# EAGLE design Proiect (EAGLE 9.7.0)

## Sheet 1 of 2
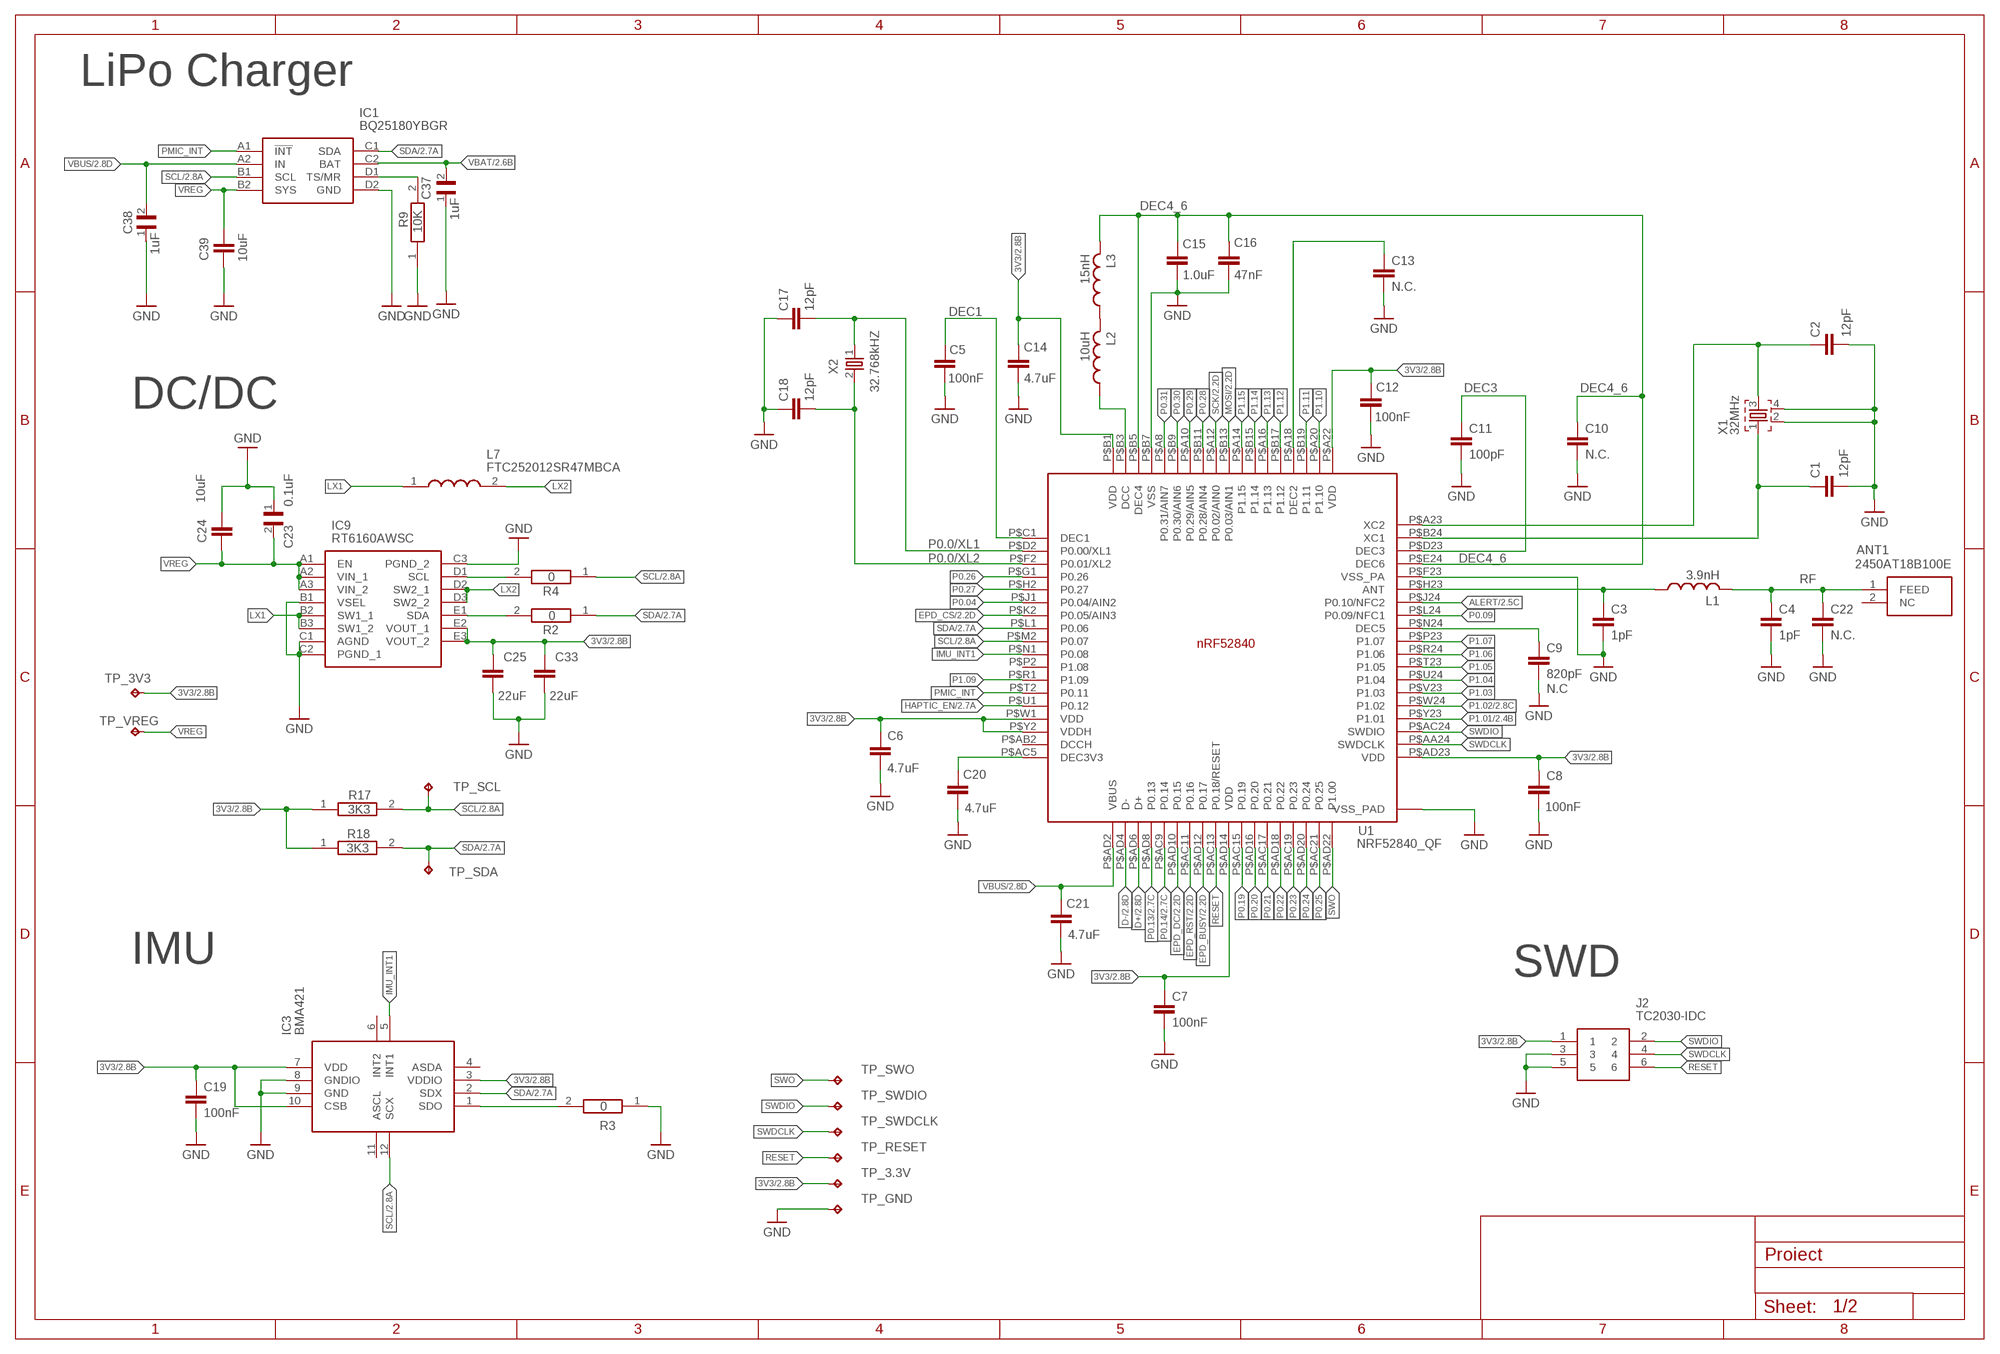
[diagram p0: schematic, sheet 1]

### Parts
ANT1  2450AT18B100E  2450AT18B100E_2450AT18B100E  [2450AT18B100E_ANTC3216X140N]
C1  12pF  NORDIC_NRF_3_CAPACITOR_0201_L  [NORDIC_NRF_3_RESC0201_L]
C2  12pF  NORDIC_NRF_3_CAPACITOR_0201_L  [NORDIC_NRF_3_RESC0201_L]
C3  1pF  NORDIC_NRF_3_CAPACITOR_0201_L  [NORDIC_NRF_3_RESC0201_L]
C4  1pF  NORDIC_NRF_3_CAPACITOR_0201_L  [NORDIC_NRF_3_RESC0201_L]
C5  100nF  PERFECT_0402_CAP_0402  [PERFECT_0402_0402]
C6  4.7uF  PERFECT_0402_CAP_0402  [PERFECT_0402_0402]
C7  100nF  NORDIC_NRF_3_CAPACITOR_0201_L  [NORDIC_NRF_3_RESC0201_L]
C8  100nF  NORDIC_NRF_3_CAPACITOR_0201_L  [NORDIC_NRF_3_RESC0201_L]
C9  820pF  NORDIC_NRF_3_CAPACITOR_0201_L  [NORDIC_NRF_3_RESC0201_L]
C10  N.C.  NORDIC_NRF_3_CAPACITOR_0201_L  [NORDIC_NRF_3_RESC0201_L]
C11  100pF  NORDIC_NRF_3_CAPACITOR_0201_L  [NORDIC_NRF_3_RESC0201_L]
C12  100nF  NORDIC_NRF_3_CAPACITOR_0201_L  [NORDIC_NRF_3_RESC0201_L]
C13  N.C.  NORDIC_NRF_3_CAPACITOR_0201_L  [NORDIC_NRF_3_RESC0201_L]
C14  4.7uF  PERFECT_0402_CAP_0402  [PERFECT_0402_0402]
C15  1.0uF  PERFECT_0402_CAP_0402  [PERFECT_0402_0402]
C16  47nF  NORDIC_NRF_3_CAPACITOR_0201_L  [NORDIC_NRF_3_RESC0201_L]
C17  12pF  NORDIC_NRF_3_CAPACITOR_0201_L  [NORDIC_NRF_3_RESC0201_L]
C18  12pF  NORDIC_NRF_3_CAPACITOR_0201_L  [NORDIC_NRF_3_RESC0201_L]
C19  100nF  NORDIC_NRF_3_CAPACITOR_0201_L  [NORDIC_NRF_3_RESC0201_L]
C20  4.7uF  PERFECT_0402_CAP_0402  [PERFECT_0402_0402]
C21  4.7uF  PERFECT_0402_CAP_0402  [PERFECT_0402_0402]
C22  N.C.  NORDIC_NRF_3_CAPACITOR_0201_L  [NORDIC_NRF_3_RESC0201_L]
C23  0.1uF  GRM011R60J152KE01L_1_GRM011R60J152KE01L  [GRM011R60J152KE01L_1_0201]
C24  10uF  PERFECT_0402_CAP_0402  [PERFECT_0402_0402]
C25  22uF  PERFECT_0402_CAP_0402  [PERFECT_0402_0402]
C33  22uF  PERFECT_0402_CAP_0402  [PERFECT_0402_0402]
C37  1uF  GRM011R60J152KE01L_1_GRM011R60J152KE01L  [GRM011R60J152KE01L_1_0201]
C38  1uF  GRM011R60J152KE01L_1_GRM011R60J152KE01L  [GRM011R60J152KE01L_1_0201]
C39  10uF  PERFECT_0402_CAP_0402  [PERFECT_0402_0402]
IC1  BQ25180YBGR  BQ25180YBGR_BQ25180YBGR  [BQ25180YBGR_BGA8C40P2X4_100X155X50]
IC3  BMA421  BMA423_BMA423  [BMA423_BMA423]
IC9  RT6160AWSC  RT6160AWSC_RT6160AWSC  [RT6160AWSC_BGA15C40P3X5_140X230X60]
J2  TC2030-IDC  TC2030-IDC_TC2030-IDC  [TC2030-IDC_TC2030IDC]
L1  3.9nH  NORDIC_NRF_2_INDUCTOR_0402_L  [NORDIC_NRF_2_RESC0402_L]
L2  10uH  NORDIC_NRF_2_INDUCTOR_0402_L  [NORDIC_NRF_2_RESC0402_L]
L3  15nH  NORDIC_NRF_2_INDUCTOR_0402_L  [NORDIC_NRF_2_RESC0402_L]
L7  FTC252012SR47MBCA  MLP2016SR47MT0S1_FTC252012SR47MBCA  [MLP2016SR47MT0S1_INDC2016X100N]
R2  0  ERA-1AEB3401C_CPF0201D7K68C1  [ERA-1AEB3401C_0201]
R3  0  ERA-1AEB3401C_CPF0201D7K68C1  [ERA-1AEB3401C_0201]
R4  0  ERA-1AEB3401C_CPF0201D7K68C1  [ERA-1AEB3401C_0201]
R9  10K  ERA-1AEB3401C_CPF0201D7K68C1  [ERA-1AEB3401C_0201]
R17  3K3  ERA-1AEB3401C_CPF0201D7K68C1  [ERA-1AEB3401C_0201]
R18  3K3  ERA-1AEB3401C_CPF0201D7K68C1  [ERA-1AEB3401C_0201]
TP_3.3V  HECTOR_WATCH_1_TPTP20R  [HECTOR_WATCH_1_TP20R]
TP_3V3  HECTOR_WATCH_1_TPTP20R  [HECTOR_WATCH_1_TP20R]
TP_GND  HECTOR_WATCH_1_TPTP20R  [HECTOR_WATCH_1_TP20R]
TP_RESET  HECTOR_WATCH_1_TPTP20R  [HECTOR_WATCH_1_TP20R]
TP_SCL  HECTOR_WATCH_1_TPTP20R  [HECTOR_WATCH_1_TP20R]
TP_SDA  HECTOR_WATCH_1_TPTP20R  [HECTOR_WATCH_1_TP20R]
TP_SWDCLK  HECTOR_WATCH_1_TPTP20R  [HECTOR_WATCH_1_TP20R]
TP_SWDIO  HECTOR_WATCH_1_TPTP20R  [HECTOR_WATCH_1_TP20R]
TP_SWO  HECTOR_WATCH_1_TPTP20R  [HECTOR_WATCH_1_TP20R]
TP_VREG  HECTOR_WATCH_1_TPTP20R  [HECTOR_WATCH_1_TP20R]
U1  NRF52840_QF  NORDIC_NRF_4_NRF52840_QF  [NORDIC_NRF_4_AQFN50P700X700X85_HS-74N]
X1  32MHz  NORDIC_NRF_XTAL_32MHZ  [NORDIC_NRF_BT-XTAL_2016_N]
X2  32.768kHZ  NORDIC_NRF_1_XTAL_32KHZ  [NORDIC_NRF_1_XTAL_3215_N]

### Nets
3V3: C6.1 C7.1 C8.1 C12.1 C14.1 C19.1 C25.1 C33.1 IC3.3(VDDIO) IC3.7(VDD) IC3.10(CSB) IC9.E2(VOUT_1) IC9.E3(VOUT_2) J2.1 R17.1 R18.1 TP_3.3V.TP TP_3V3.TP U1.P$A22(VDD) U1.P$AD14(VDD) U1.P$AD23(VDD) U1.P$B1(VDD) U1.P$W1(VDD) U1.P$Y2(VDDH) ; also sheet 2
ALERT: U1.P$J24(P0.10/NFC2) ; also sheet 2
D+: U1.P$AD6(D+) ; also sheet 2
D-: U1.P$AD4(D-) ; also sheet 2
DEC1: C5.1 U1.P$C1(DEC1)
DEC3: C11.1 U1.P$D23(DEC3)
DEC4_6: C10.1 C15.1 C16.1 L3.2 U1.P$B5(DEC4) U1.P$E24(DEC6)
EPD_BUSY: U1.P$AD12(P0.17) ; also sheet 2
EPD_CS: U1.P$K2(P0.05/AIN3) ; also sheet 2
EPD_DC: U1.P$AD10(P0.15) ; also sheet 2
EPD_RST: U1.P$AC11(P0.16) ; also sheet 2
GND: C1.1 C2.1 C3.2 C4.2 C5.2 C6.2 C7.2 C8.2 C9.2 C10.2 C11.2 C12.2 C13.2 C14.2 C15.2 C16.2 C17.1 C18.1 C19.2 C20.2 C21.2 C22.2 C23.1 C24.1 C25.2 C33.2 C37.1 C38.1 C39.2 IC1.D2(GND) IC3.8(GNDIO) IC3.9(GND) IC9.B1(VSEL) IC9.C1(AGND) IC9.C2(PGND_1) IC9.C3(PGND_2) J2.3 J2.5 R3.1 R9.1 TP_GND.TP U1.P$74(VSS_PAD) U1.P$75(VSS_PAD) U1.P$76(VSS_PAD) U1.P$77(VSS_PAD) U1.P$78(VSS_PAD) U1.P$79(VSS_PAD) U1.P$80(VSS_PAD) U1.P$81(VSS_PAD) U1.P$82(VSS_PAD) U1.P$83(VSS_PAD) U1.P$84(VSS_PAD) U1.P$85(VSS_PAD) U1.P$86(VSS_PAD) U1.P$87(VSS_PAD) U1.P$88(VSS_PAD) U1.P$89(VSS_PAD) U1.P$90(VSS_PAD) U1.P$B7(VSS) U1.P$F23(VSS_PA) X1.2 X1.4 ; also sheet 2
HAPTIC_EN: U1.P$U1(P0.12) ; also sheet 2
IMU_INT1: IC3.5(INT1) U1.P$N1(P0.08)
LX1: IC9.B2(SW1_1) IC9.B3(SW1_2) L7.1
LX2: IC9.D2(SW2_1) IC9.D3(SW2_2) L7.2
MOSI: U1.P$B13(P0.03/AIN1) ; also sheet 2
N$1: IC1.D1(TS/MR) R9.2
N$2: IC9.D1(SCL) R4.2
N$3: IC9.E1(SDA) R2.2
N$4: C9.1 U1.P$N24(DEC5)
N$5: C3.1 L1.1 U1.P$H23(ANT)
N$9: IC3.1(SDO) R3.2
N$10: L2.1 U1.P$B3(DCC)
N$11: L2.2 L3.1
N$12: C1.2 U1.P$B24(XC1) X1.1
N$13: C13.1 U1.P$A18(DEC2)
N$16: C2.2 U1.P$A23(XC2) X1.3
P0.0/XL1: C17.2 U1.P$D2(P0.00/XL1) X2.1
P0.0/XL2: C18.2 U1.P$F2(P0.01/XL2) X2.2
P0.04: U1.P$J1(P0.04/AIN2)
P0.09: U1.P$L24(P0.09/NFC1)
P0.13: U1.P$AD8(P0.13) ; also sheet 2
P0.14: U1.P$AC9(P0.14) ; also sheet 2
P0.19: U1.P$AC15(P0.19)
P0.20: U1.P$AD16(P0.20)
P0.21: U1.P$AC17(P0.21)
P0.22: U1.P$AD18(P0.22)
P0.23: U1.P$AC19(P0.23)
P0.24: U1.P$AD20(P0.24)
P0.25: U1.P$AC21(P0.25)
P0.26: U1.P$G1(P0.26)
P0.27: U1.P$H2(P0.27)
P0.28: U1.P$B11(P0.28/AIN4)
P0.29: U1.P$A10(P0.29/AIN5)
P0.30: U1.P$B9(P0.30/AIN6)
P0.31: U1.P$A8(P0.31/AIN7)
P1.01: U1.P$Y23(P1.01) ; also sheet 2
P1.02: U1.P$W24(P1.02) ; also sheet 2
P1.03: U1.P$V23(P1.03)
P1.04: U1.P$U24(P1.04)
P1.05: U1.P$T23(P1.05)
P1.06: U1.P$R24(P1.06)
P1.07: U1.P$P23(P1.07)
P1.09: U1.P$R1(P1.09)
P1.10: U1.P$A20(P1.10)
P1.11: U1.P$B19(P1.11)
P1.12: U1.P$B17(P1.12)
P1.13: U1.P$A16(P1.13)
P1.14: U1.P$B15(P1.14)
P1.15: U1.P$A14(P1.15)
PMIC_INT: IC1.A1(!INT) U1.P$T2(P0.11)
RESET: J2.6 TP_RESET.TP U1.P$AC13(P0.18/RESET)
RF: ANT1.1(FEED) C4.1 C22.1 L1.2
SCK: U1.P$A12(P0.02/AIN0) ; also sheet 2
SCL: IC1.B1(SCL) IC3.12(SCX) R4.1 R17.2 TP_SCL.TP U1.P$M2(P0.07) ; also sheet 2
SDA: IC1.C1(SDA) IC3.2(SDX) R2.1 R18.2 TP_SDA.TP U1.P$L1(P0.06) ; also sheet 2
SWDCLK: J2.4 TP_SWDCLK.TP U1.P$AA24(SWDCLK)
SWDIO: J2.2 TP_SWDIO.TP U1.P$AC24(SWDIO)
SWO: TP_SWO.TP U1.P$AD22(P1.00)
VBAT: C37.2 IC1.C2(BAT) ; also sheet 2
VBUS: C21.1 C38.2 IC1.A2(IN) U1.P$AD2(VBUS) ; also sheet 2
VBUS/2.6D1: C20.1 U1.P$AC5(DEC3V3)
VREG: C23.2 C24.2 C39.1 IC1.B2(SYS) IC9.A1(EN) IC9.A2(VIN_1) IC9.A3(VIN_2) TP_VREG.TP
Unconnected: ANT1.2(NC) IC3.4(ASDA) IC3.6(INT2) IC3.11(ASCL) U1.P$AB2(DCCH) U1.P$P2(P1.08)

### Notes on the sheet
- LiPo Charger
- DC/DC
- N.C
- IMU | SWD

## Sheet 2 of 2
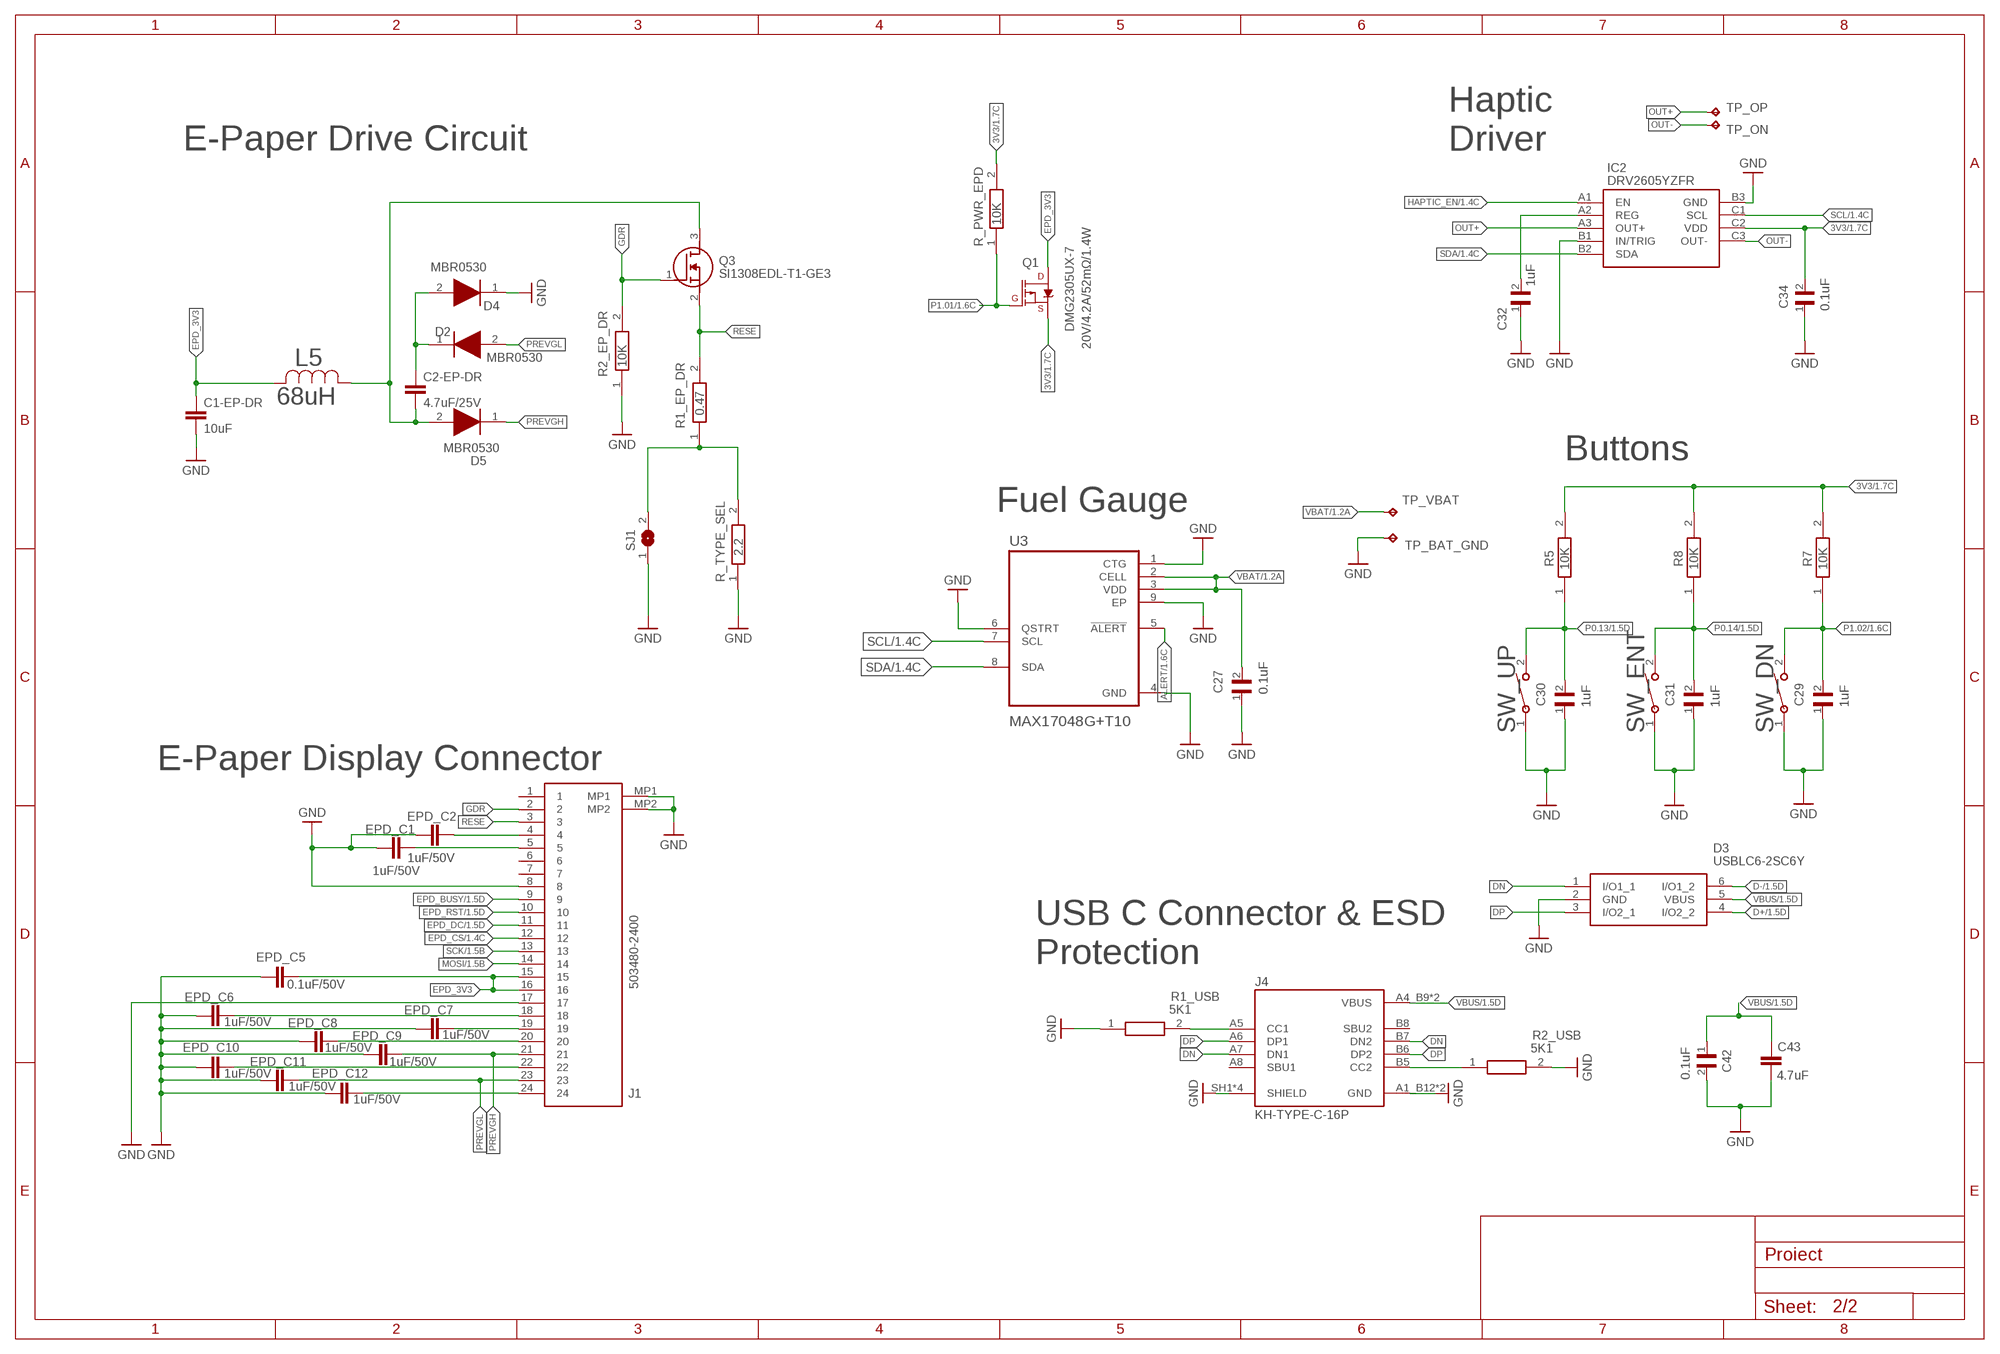
[diagram p1: schematic, sheet 2]

### Parts
C1-EP-DR  10uF  PERFECT_0402_CAP_0402  [PERFECT_0402_0402]
C2-EP-DR  4.7uF/25V  PERFECT_0402_CAP_0402  [PERFECT_0402_0402]
C27  0.1uF  GRM011R60J152KE01L_1_GRM011R60J152KE01L  [GRM011R60J152KE01L_1_0201]
C29  1uF  GRM011R60J152KE01L_1_GRM011R60J152KE01L  [GRM011R60J152KE01L_1_0201]
C30  1uF  GRM011R60J152KE01L_1_GRM011R60J152KE01L  [GRM011R60J152KE01L_1_0201]
C31  1uF  GRM011R60J152KE01L_1_GRM011R60J152KE01L  [GRM011R60J152KE01L_1_0201]
C32  1uF  GRM011R60J152KE01L_1_GRM011R60J152KE01L  [GRM011R60J152KE01L_1_0201]
C34  0.1uF  GRM011R60J152KE01L_1_GRM011R60J152KE01L  [GRM011R60J152KE01L_1_0201]
C42  0.1uF  GRM011R60J152KE01L_1_GRM011R60J152KE01L  [GRM011R60J152KE01L_1_0201]
C43  4.7uF  PERFECT_0402_CAP_0402  [PERFECT_0402_0402]
D2  MBR0530  ESP32_C6_LIBRARY_5_MBR0530  [ESP32_C6_LIBRARY_5_SOD3716X135N]
D3  USBLC6-2SC6Y  ESP32_C6_LIBRARY_3_USBLC6-2SC6Y  [ESP32_C6_LIBRARY_3_SOT95P280X145-6N]
D4  MBR0530  ESP32_C6_LIBRARY_5_MBR0530  [ESP32_C6_LIBRARY_5_SOD3716X135N]
D5  MBR0530  ESP32_C6_LIBRARY_5_MBR0530  [ESP32_C6_LIBRARY_5_SOD3716X135N]
EPD_C1  1uF/50V  PERFECT_0402_CAP_0402  [PERFECT_0402_0402]
EPD_C2  1uF/50V  PERFECT_0402_CAP_0402  [PERFECT_0402_0402]
EPD_C5  0.1uF/50V  NORDIC_NRF_3_CAPACITOR_0201_L  [NORDIC_NRF_3_RESC0201_L]
EPD_C6  1uF/50V  PERFECT_0402_CAP_0402  [PERFECT_0402_0402]
EPD_C7  1uF/50V  PERFECT_0402_CAP_0402  [PERFECT_0402_0402]
EPD_C8  1uF/50V  PERFECT_0402_CAP_0402  [PERFECT_0402_0402]
EPD_C9  1uF/50V  PERFECT_0402_CAP_0402  [PERFECT_0402_0402]
EPD_C10  1uF/50V  PERFECT_0402_CAP_0402  [PERFECT_0402_0402]
EPD_C11  1uF/50V  PERFECT_0402_CAP_0402  [PERFECT_0402_0402]
EPD_C12  1uF/50V  PERFECT_0402_CAP_0402  [PERFECT_0402_0402]
IC2  DRV2605YZFR  DRV2605YZFR_DRV2605YZFR  [DRV2605YZFR_BGA9C50P3X3_144X144X62]
J1  503480-2400  503480-2400_503480-2400  [503480-2400_5034802400]
J4  KH-TYPE-C-16P  KH-TYPE-C-16P_KH-TYPE-C-16P  [KH-TYPE-C-16P_KINGHELM_KH-TYPE-C-16P]
L5  68uH  ESP32_C6_LIBRARY_2_744043680IND_4828-WE-TPC_WRE  [ESP32_C6_LIBRARY_2_IND_4828-WE-TPC_WRE]
Q1  20V/4.2A/52mΩ/1.4W  ESP32_C6_LIBRARY_4_ESP32_WROVER_SPARKFUN-DISCRETESEMI_MOSFET_PCH-DMG2305UX-7  [ESP32_C6_LIBRARY_4_ESP32_C6_LIBRARY_4_ESP32_C6_LIBRARY_4_ESP32_C6_LIBRARY_4_ESP32_WROVER_SPARKFUN-DISCRETESEMI_SOT23-3]
Q3  SI1308EDL-T1-GE3  ESP32_C6_LIBRARY_6_SI1308EDL-T1-GE3  [ESP32_C6_LIBRARY_6_SOT65P210X110-3N]
R1_EP_DR  0.47  ERA-1AEB3401C_CPF0201D7K68C1  [ERA-1AEB3401C_0201]
R1_USB  5K1  ERA-1AEB3401C_CPF0201D7K68C1  [ERA-1AEB3401C_0201]
R2_EP_DR  10K  ERA-1AEB3401C_CPF0201D7K68C1  [ERA-1AEB3401C_0201]
R2_USB  5K1  ERA-1AEB3401C_CPF0201D7K68C1  [ERA-1AEB3401C_0201]
R5  10K  ERA-1AEB3401C_CPF0201D7K68C1  [ERA-1AEB3401C_0201]
R7  10K  ERA-1AEB3401C_CPF0201D7K68C1  [ERA-1AEB3401C_0201]
R8  10K  ERA-1AEB3401C_CPF0201D7K68C1  [ERA-1AEB3401C_0201]
R_PWR_EPD  10K  ERA-1AEB3401C_CPF0201D7K68C1  [ERA-1AEB3401C_0201]
R_TYPE_SEL  2.2  ERA-1AEB3401C_CPF0201D7K68C1  [ERA-1AEB3401C_0201]
SJ1  ESP32_C6_LIBRARY_7_JUMPER_SJ  [ESP32_C6_LIBRARY_7_JUMPER_SJ]
SW_DN  2025-10-22_07-23-44_LIBRARY_EVP-AKE31ASW_EVP-AKE31A_PAN  [2025-10-22_07-23-44_LIBRARY_SW_EVP-AKE31A_PAN]
SW_ENT  2025-10-22_07-23-44_LIBRARY_EVP-AKE31ASW_EVP-AKE31A_PAN  [2025-10-22_07-23-44_LIBRARY_SW_EVP-AKE31A_PAN]
SW_UP  2025-10-22_07-23-44_LIBRARY_EVP-AKE31ASW_EVP-AKE31A_PAN  [2025-10-22_07-23-44_LIBRARY_SW_EVP-AKE31A_PAN]
TP_BAT_GND  HECTOR_WATCH_1_TPTP20R  [HECTOR_WATCH_1_TP20R]
TP_ON  HECTOR_WATCH_1_TPTP20R  [HECTOR_WATCH_1_TP20R]
TP_OP  HECTOR_WATCH_1_TPTP20R  [HECTOR_WATCH_1_TP20R]
TP_VBAT  HECTOR_WATCH_1_TPTP20R  [HECTOR_WATCH_1_TP20R]
U3  MAX17048G+T10  ESP32_C6_LIBRARY_MAX17048G+T10  [ESP32_C6_LIBRARY_SON50P200X200X80-9N]

### Nets
3V3: C34.2 IC2.C2(VDD) Q1.2(S) R5.2 R7.2 R8.2 R_PWR_EPD.2 ; also sheet 1
ALERT: U3.5(!ALERT) ; also sheet 1
D+: D3.4(I/O2_2) ; also sheet 1
D-: D3.6(I/O1_2) ; also sheet 1
DN: D3.1(I/O1_1) J4.A7(DN1) J4.B7(DN2)
DP: D3.3(I/O2_1) J4.A6(DP1) J4.B6(DP2)
EPD_3V1: C2-EP-DR.1 D2.1(K) D4.2(A)
EPD_3V3: C1-EP-DR.1 EPD_C5.2 J1.15 J1.16 L5.2 Q1.3(D)
EPD_BUSY: J1.9 ; also sheet 1
EPD_CS: J1.12 ; also sheet 1
EPD_DC: J1.11 ; also sheet 1
EPD_RST: J1.10 ; also sheet 1
GDR: J1.2 Q3.1(G) R2_EP_DR.2
GND: C1-EP-DR.2 C27.1 C29.1 C30.1 C31.1 C32.1 C34.1 C42.2 C43.1 D3.2(GND) D4.1(K) EPD_C1.1 EPD_C2.1 EPD_C5.1 EPD_C6.1 EPD_C7.1 EPD_C8.1 EPD_C9.1 EPD_C10.1 EPD_C11.1 EPD_C12.1 IC2.B1(IN/TRIG) IC2.B3(GND) J1.8 J1.17 J1.MP1 J1.MP2 J4.A1_B12(GND) J4.A12_B1(GND) J4.SH1(SHIELD) J4.SH2(SHIELD) J4.SH3(SHIELD) J4.SH4(SHIELD) R1_USB.1 R2_EP_DR.1 R2_USB.2 R_TYPE_SEL.1 SJ1.1 SW_DN.1 SW_ENT.1 SW_UP.1 TP_BAT_GND.TP U3.1(CTG) U3.4(GND) U3.6(QSTRT) U3.9(EP) ; also sheet 1
GND1: R1_EP_DR.1 R_TYPE_SEL.2 SJ1.2
GND2: J4.A5(CC1) R1_USB.2
HAPTIC_EN: IC2.A1(EN) ; also sheet 1
MOSI: J1.14 ; also sheet 1
N$17: C2-EP-DR.2 D5.2(A) L5.1 Q3.3(D)
N$18: EPD_C2.2 J1.4
N$19: EPD_C1.2 J1.5
N$21: EPD_C6.2 J1.18
N$22: EPD_C7.2 J1.19
N$23: J4.B5(CC2) R2_USB.1
N$24: EPD_C8.2 J1.20
N$26: EPD_C10.2 J1.22
N$28: EPD_C12.2 J1.24
OUT+: IC2.A3(OUT+) TP_OP.TP
OUT-: IC2.C3(OUT-) TP_ON.TP
P0.13: C30.2 R5.1 SW_UP.2 ; also sheet 1
P0.13/1.5D1: C32.2 IC2.A2(REG)
P0.14: C31.2 R8.1 SW_ENT.2 ; also sheet 1
P1.01: Q1.1(G) R_PWR_EPD.1 ; also sheet 1
P1.02: C29.2 R7.1 SW_DN.2 ; also sheet 1
PREVGH: D5.1(K) EPD_C9.2 J1.21
PREVGL: D2.2(A) EPD_C11.2 J1.23
RESE: J1.3 Q3.2(S) R1_EP_DR.2
SCK: J1.13 ; also sheet 1
SCL: IC2.C1(SCL) U3.7(SCL) ; also sheet 1
SDA: IC2.B2(SDA) U3.8(SDA) ; also sheet 1
VBAT: C27.2 TP_VBAT.TP U3.2(CELL) U3.3(VDD) ; also sheet 1
VBUS: C42.1 C43.2 D3.5(VBUS) J4.A4_B9(VBUS) J4.A9_B4(VBUS) ; also sheet 1
Unconnected: J1.1 J1.6 J1.7 J4.A8(SBU1) J4.B8(SBU2)

### Notes on the sheet
- E-Paper Drive Circuit
- Haptic 
  Driver
- DMG2305UX-7
- Buttons
- Fuel Gauge
- E-Paper Display Connector
- USB C Connector & ESD 
  Protection

## Library data of the parts
ANT1 = InkTime_v5:2450AT18B100E_2450AT18B100E: Antennas 2.45GHz ANTENNA Source: Datasheet <https://www.johansontechnology.com/datasheets/2450AT18B100/2450AT18B100.pdf>
C1-C4 C7-C13 C16-C19 C22 EPD_C5 = InkTime_v5:NORDIC_NRF_3_CAPACITOR: Generic chip capacitor
C1-EP-DR C2-EP-DR C5 C6 C14 C15 C20 C21 C24 C25 C33 C39 C43 EPD_C1 EPD_C2 EPD_C6-EPD_C12 = InkTime_v5:PERFECT_0402_CAP_0402: 0402 (1005 Metric) Nick Garner - TeleSense
C23 C27 C29-C32 C34 C37 C38 C42 = InkTime_v5:GRM011R60J152KE01L_1_GRM011R60J152KE01L: Check availability <https://pricing.snapeda.com/parts/GRM011R60J152KE01L/Murata/view-part?ref=eda>
D2 D4 D5 = InkTime_v5:ESP32_C6_LIBRARY_5_MBR0530: ON SEMICONDUCTOR - MBR0530 - DIODE, SCHOTTKY, 0.5A, 30V, SOD-123 Source: Datasheet <http://www.onsemi.com/pub/Collateral/MBR0530T1-D.PDF> Check availability <https://pricing.snapeda.com/parts/MBR0530/ON%20Semiconductor/view-part?ref=eda>
D3 = InkTime_v5:ESP32_C6_LIBRARY_3_USBLC6-2SC6Y: Low Cap. ESD Protection Auto SOT-23-6 STMicroelectronics USBLC6-2SC6Y, Dual Uni-Directional TVS Diode Array, 6-Pin SOT-23 Source: Datasheet <https://componentsearchengine.com/Datasheets/1/USBLC6-2SC6Y.pdf> Check availability <https://pricing.snapeda.com/parts/USBLC6-2SC6Y/STMicroelectronics/view-part?ref=eda>
IC1 = InkTime_v5:BQ25180YBGR_BQ25180YBGR: Charger IC Lithium Ion/Polymer, Lithium Iron Phosphate 8-DSBGA (1.6x1.1) Source: Datasheet <https://www.ti.com/lit/ds/symlink/bq25180.pdf?ts=1650264094470&ref_url=https%3A%2F%2Fwww.ti.com%2Fproduct%2FBQ25180>
IC2 = InkTime_v5:DRV2605YZFR_DRV2605YZFR: Haptic Driver for ERM/LRA with Built-In Library and Smart Loop Architecture Source: Datasheet <http://www.ti.com/lit/gpn/drv2605>
IC3 = InkTime_v5:BMA423_BMA423: Accelerometers Triaxial low-g 12bit Acceleration Sensor Source: Datasheet <https://www.mouser.com/datasheet/2/783/BST-BMA423-DS000-1509600.pdf>
IC9 = InkTime_v5:RT6160AWSC_RT6160AWSC: Buck-Boost Regulator Positive Output Step-Up/Step-Down I2C DC-DC Controller IC 15-WL-CSP (BSC) (1.4x2.3) Source: Datasheet <https://www.richtek.com/SaveDownload.aspx?specid=RT6160A>
J1 = InkTime_v5:503480-2400_503480-2400: FFC & FPC Connectors 0.5mm FPC RA SMT Dual Contact 24Ckt Source: Datasheet <https://componentsearchengine.com/Datasheets/1/503480-2400.pdf>
J2 = InkTime_v5:TC2030-IDC_TC2030-IDC: CABLE ADAPTER 6 POS Source: Datasheet <https://datasheet.datasheetarchive.com/originals/distributors/Datasheets_SAMA/62bc384e093448baaaa63dbd0b9d8707.pdf>
J4 = InkTime_v5:KH-TYPE-C-16P_KH-TYPE-C-16P: Check availability <https://pricing.snapeda.com/parts/KH-TYPE-C-16P/kinghelm/view-part?ref=eda>
L1-L3 = InkTime_v5:NORDIC_NRF_2_INDUCTOR: Generic chip inductor
L5 = InkTime_v5:ESP32_C6_LIBRARY_2_744043680
L7 = InkTime_v5:MLP2016SR47MT0S1_FTC252012SR47MBCA: SMD / SMT Inductors (Coils), L=0.47?H, L x W x T : Source: Datasheet <https://product.tdk.com/system/files/dam/doc/product/inductor/inductor/smd/catalog/inductor_commercial_power_mlp2016_en.pdf>
Q1 = InkTime_v5:ESP32_C6_LIBRARY_4_ESP32_WROVER_SPARKFUN-DISCRETESEMI_MOSFET_PCH: P-channel MOSFETs Voltage controlled devices that allow control of high current outputs. SparkFun Products: SparkFun ESP32 Thing <https://www.sparkfun.com/products/13907> SparkFun ESP8266 Thing <https://www.sparkfun.com/products/13231> SparkFun Pi Servo HAT V2 <https://www.sparkfun.com/products/15316> DMG2305UX-7 (20V/4.2A/SOT23-3)
Q3 = InkTime_v5:ESP32_C6_LIBRARY_6_SI1308EDL-T1-GE3: MOSFET N-Ch 30V 1.5A TrenchFET SC70 Vishay Si1308EDL-T1-GE3 N-channel MOSFET Transistor, 1.5 A, 30 V, 3-Pin SC-70 Source: Datasheet <https://componentsearchengine.com/Datasheets/1/SI1308EDL-T1-GE3.pdf> Check availability <https://pricing.snapeda.com/parts/SI1308EDL-T1-GE3/Vishay%20Siliconix/view-part?ref=eda>
R1_EP_DR R1_USB R2 R2_EP_DR R2_USB R3-R5 R7-R9 R17 R18 R_PWR_EPD R_TYPE_SEL = InkTime_v5:ERA-1AEB3401C_CPF0201D7K68C1: 7.68k 0201 Thin Film Surface Mount Fixed Resistor +/-0.5% 0.031W CPF0201D7K68C1 Source: Datasheet <http://www.te.com/commerce/DocumentDelivery/DDEController?Action=showdoc&DocId=Data Sheet1773200-1ApdfEnglishENG_DS_1773200-1_A.pdf4-2176215-6>
SJ1 = InkTime_v5:ESP32_C6_LIBRARY_7_JUMPER_SJ: SMD solder JUMPER
SW_DN SW_ENT SW_UP = InkTime_v5:2025-10-22_07-23-44_LIBRARY_EVP-AKE31A
TP_3.3V TP_3V3 TP_BAT_GND TP_GND TP_ON TP_OP TP_RESET TP_SCL TP_SDA TP_SWDCLK TP_SWDIO TP_SWO TP_VBAT TP_VREG = InkTime_v5:HECTOR_WATCH_1_TP: Test pad
U1 = InkTime_v5:NORDIC_NRF_4_NRF52840_QF: nRF52840 Features Advanced Single chip 2.4 GHz multi-protocol SoC 32-bit ARM Cortex-M4F Processor 1.7v to 5.5v operation 1MB flash + 256kB RAM Bluetooth 5 support for long range and high throughput 802.15.4 radio support On-chip NFC PPI –Programmable Peripheral Interconnect Automated power management system with automatic power management of each peripheral Configurable I/O mapping for analog and digital I/O 48 x GPIO 1 x QSPI 4 x Master/Slave SPI 2 x Two-wire interface (I²C) I²S interface 2 x UART 4 x PWM USB 2.0 controller ARM TrustZone CryptoCell-310 Cryptographic and security module AES 128-bit ECB/CCM/AAR hardware accelerator Digital microphone interface (PDM) Quadrature decoder 12-bit ADC Low power comparator On-chip 50Ω balun On-air compatible with nRF52, nRF51 and nRF24 Series Applications Advanced high performance wearables Wearables for secure payments Virtual Reality/Augmented Reality systems Smart Home sensor networks Smart city sensor networks High performance HID controllers Internet of Things (IoT) sensor networks Smart door locks Smart lighting networks Connected white goods
U3 = InkTime_v5:ESP32_C6_LIBRARY_MAX17048G+T10: Check availability <https://pricing.snapeda.com/parts/MAX17048G%2BT10/Analog%20Devices/view-part?ref=eda>
X1 = InkTime_v5:NORDIC_NRF_XTAL_32MHZ
X2 = InkTime_v5:NORDIC_NRF_1_XTAL_32KHZ

## Net classes
1 Power: width 0.3 mm

## Board
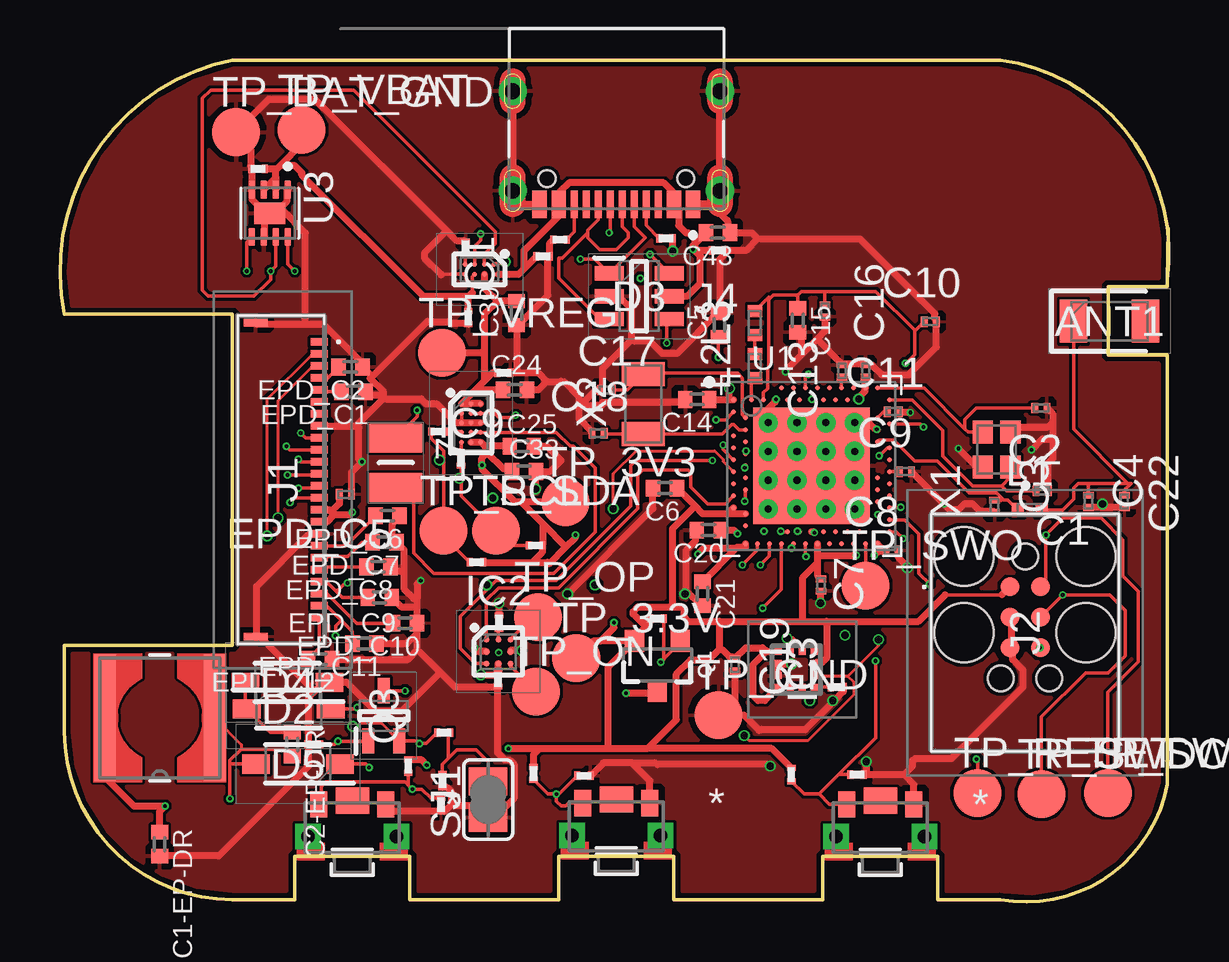
[diagram p2: board, top side]
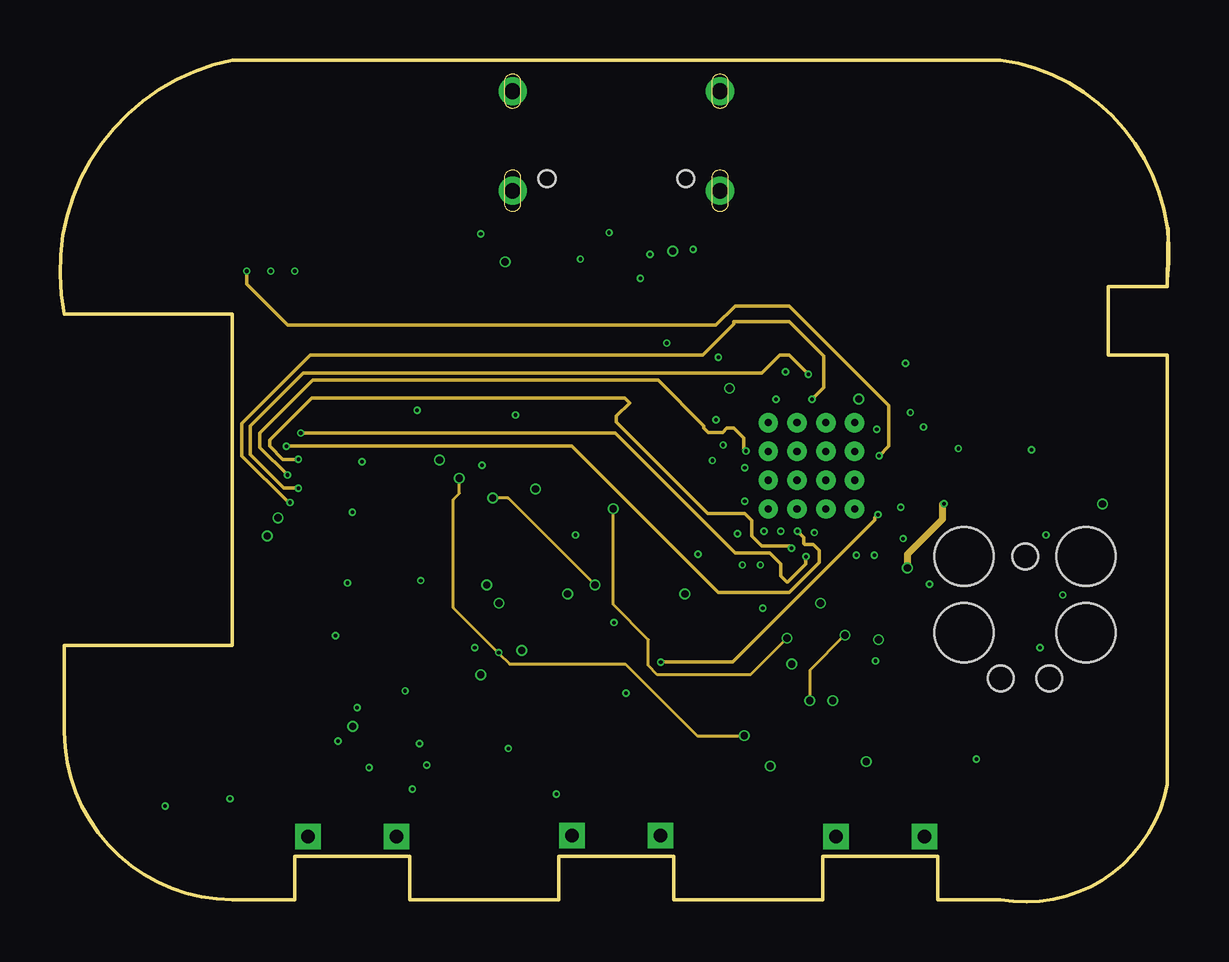
[diagram p3: board, inner layer Route2]
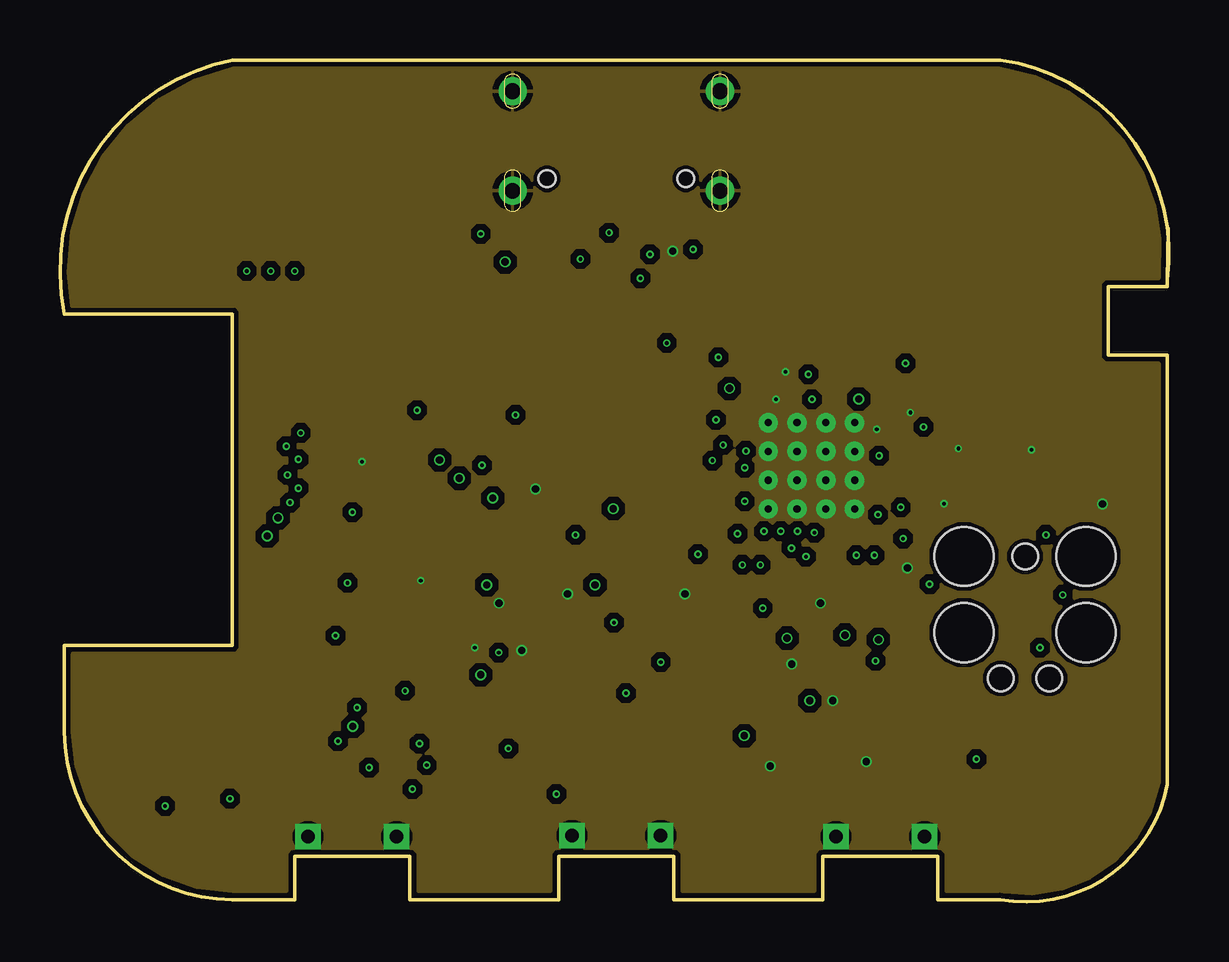
[diagram p4: board, inner layer Route63]
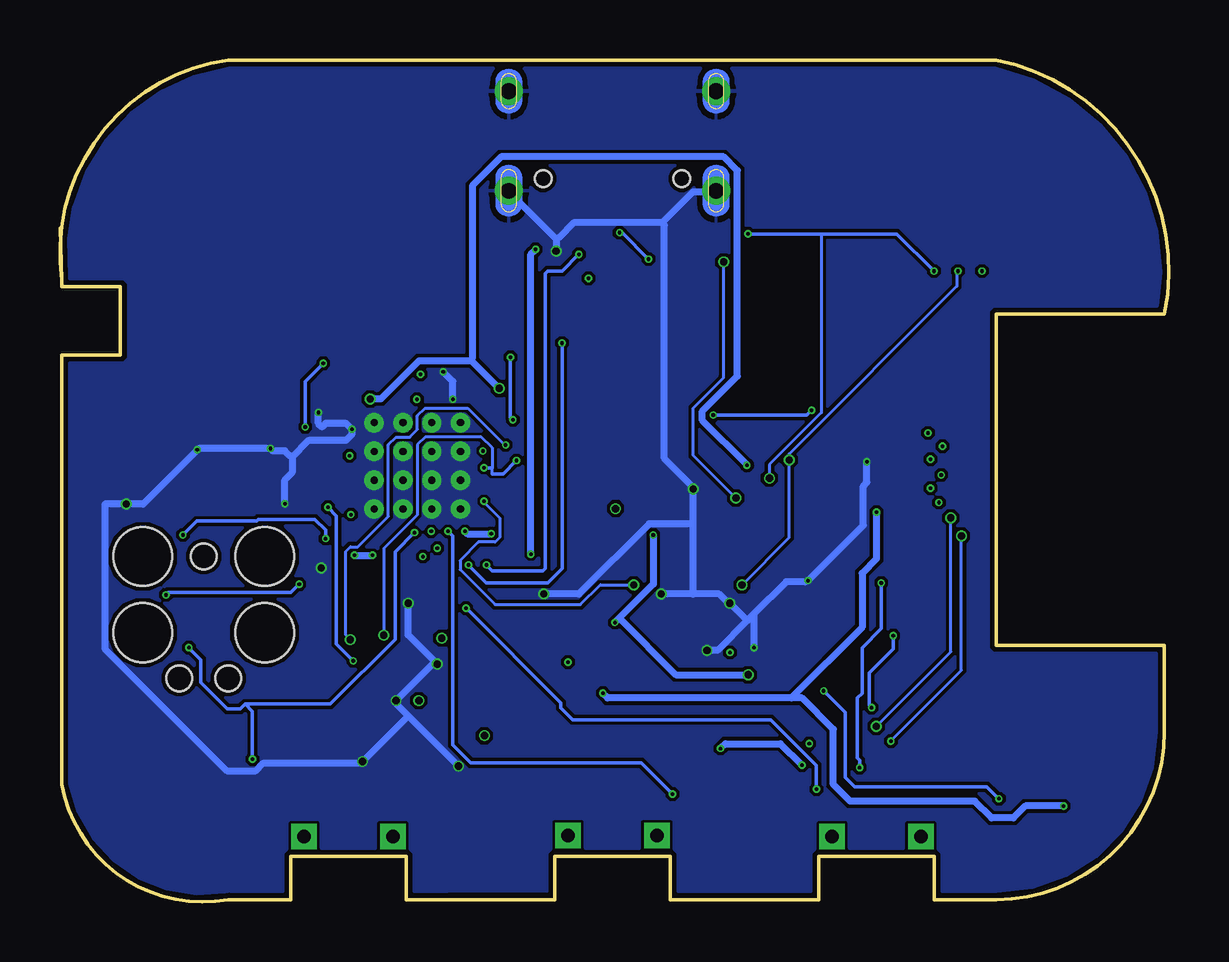
[diagram p5: board, bottom side, seen from below]

Size 46.2 x 35.1 mm. Coordinates in mm from the lower left corner, seen from the top.
Outline: 46.13,25.9 46.13,25.65 43.68,25.65 43.68,22.8 46.13,22.8 46.13,4.9 arc-90 39.18,0.1 36.58,0.1 36.58,1.9 31.78,1.9 31.78,0.1 30.18,0.1 27.18,0.1 25.58,0.1 25.58,1.9 20.78,1.9 20.78,0.1 14.58,0.1 14.58,1.9 9.78,1.9 9.78,0.1 7.18,0.1 arc-90 0.18,7.1 0.18,10.7 7.18,10.7 7.18,24.5 0.18,24.5 arc-90 7.18,35.1 39.18,35.1 arc-90 46.13,25.9
Outline: 46.13,25.9 46.18,28.1
Copper layers (1+2*15+16): Top / Route2 / Route63 / Bottom
Stack-up 4 Layer Stack: Top SilkScreen Epoxy Ink / Top SolderMask SR:Green 0.0254mm Dk 4.3 / Top Surface Finish Lead-Free 0.02mm / Top CuFoil:007 0.035mm / Dielectric-1 Prepreg:001 0.064mm / Dielectric-2 Prepreg:001 0.064mm / Route2 CuFoil:007 0.035mm / Dielectric-3 User Defined 0.5132mm / Route63 CuFoil:007 0.035mm / Dielectric-4 Prepreg:001 0.064mm / Dielectric-5 Prepreg:001 0.064mm / Bottom CuFoil:007 0.035mm / Bottom Surface Finish Lead-Free 0.02mm / Bottom SolderMask SR:Green 0.0254mm Dk 4.3 / Bottom SilkScreen Epoxy Ink
Design rules: minimum copper width classes=1 0.3mm, minimum copper width 5mil, minimum drill size 0.15mm, copper clearance wire_polygon to wire_polygon 5mil, copper clearance wire_polygon to pad_smd 5mil, copper clearance wire_polygon to via 5mil, copper clearance pad_smd to pad_smd 5mil, copper clearance pad_smd to via 5mil, copper clearance via to via 5mil, copper clearance smd to pad (same net) 5mil, copper clearance smd to via (same net) 5mil, copper clearance smd to smd (same net) 5mil, dimension clearance 0.2mm, restrict clearance 0mil, via restrict clearance 0mil, drill distance 6mil

### Footprints (pad centres in the part's own frame; a part is rotated, then mirrored left to right if it is on the bottom)
2450AT18B100E_ANTC3216X140N = smd 1.15 x 1.8: 1 -1.5,0; 2 1.5,0
NORDIC_NRF_3_RESC0201_L = smd 0.28 x 0.43: 1 -0.255,0; 2 0.255,0
PERFECT_0402_0402 = smd 0.6 x 0.7: 1 -0.5,0; 2 0.5,0
GRM011R60J152KE01L_1_0201 = smd 0.35 x 0.25: 1 0,0.275; 2 0,-0.275
ESP32_C6_LIBRARY_5_SOD3716X135N = smd 1.15 x 0.8: 1 -1.75,0; 2 1.75,0
ESP32_C6_LIBRARY_3_SOT95P280X145-6N = smd 1.2 x 0.6: 1 -1.25,0.95; 2 -1.25,0; 3 -1.25,-0.95; 4 1.25,-0.95; 5 1.25,0; 6 1.25,0.95
BQ25180YBGR_BGA8C40P2X4_100X155X50 = smd 0.2 x 0.2: A1 -0.2,0.6; A2 0.2,0.6; B1 -0.2,0.2; B2 0.2,0.2; C1 -0.2,-0.2; C2 0.2,-0.2; D1 -0.2,-0.6; D2 0.2,-0.6
DRV2605YZFR_BGA9C50P3X3_144X144X62 = smd 0.25 x 0.25: A1 -0.5,0.5; A2 0,0.5; A3 0.5,0.5; B1 -0.5,0; B2 0,0; B3 0.5,0; C1 -0.5,-0.5; C2 0,-0.5; C3 0.5,-0.5
BMA423_BMA423 = smd 0.3 x 0.35: 1 -0.75,-0.775; 2 -0.25,-0.775; 3 0.25,-0.775; 4 0.75,-0.775; 7 0.75,0.775; 8 0.25,0.775; 9 -0.25,0.775; 10 -0.75,0.775 | smd 0.35 x 0.3: 5 0.775,-0.25; 6 0.775,0.25; 11 -0.775,0.25; 12 -0.775,-0.25
RT6160AWSC_BGA15C40P3X5_140X230X60 = smd 0.216 x 0.216: A1 -0.4,0.8; A2 0,0.8; A3 0.4,0.8; B1 -0.4,0.4; B2 0,0.4; B3 0.4,0.4; C1 -0.4,0; C2 0,0; C3 0.4,0; D1 -0.4,-0.4; D2 0,-0.4; D3 0.4,-0.4; E1 -0.4,-0.8; E2 0,-0.8; E3 0.4,-0.8
503480-2400_5034802400 = smd 0.3 x 0.7: 1 -5.75,1.525; 2 -5.25,1.525; 3 -4.75,1.525; 4 -4.25,1.525; 5 -3.75,1.525; 6 -3.25,1.525; 7 -2.75,1.525; 8 -2.25,1.525; 9 -1.75,1.525; 10 -1.25,1.525; 11 -0.75,1.525; 12 -0.25,1.525; 13 0.25,1.525; 14 0.75,1.525; 15 1.25,1.525; 16 1.75,1.525; 17 2.25,1.525; 18 2.75,1.525; 19 3.25,1.525; 20 3.75,1.525; 21 4.25,1.525; 22 4.75,1.525; 23 5.25,1.525; 24 5.75,1.525 | smd 0.3 x 1: MP1 -6.54,-1.125; MP2 6.54,-1.125
TC2030-IDC_TC2030IDC = smd 0.783 x 0.783: 1 -0.953,-0.635; 2 -0.953,0.635; 3 0.317,-0.635; 4 0.317,0.635; 5 1.588,-0.635; 6 1.588,0.635 | hole 2.451: -2.223,-2.54; -2.223,2.54; 0.952,-2.54; 0.952,2.54 | hole 1.067: -2.223,0; 2.857,-1.016; 2.857,1.016
KH-TYPE-C-16P_KINGHELM_KH-TYPE-C-16P = smd 0.6 x 1.15: A1_B12 -3.2,4.725; A4_B9 -2.4,4.725; A9_B4 2.4,4.725; A12_B1 3.2,4.725 | smd 0.3 x 1.15: A5 -1.25,4.725; A6 -0.25,4.725; A7 0.25,4.725; A8 1.25,4.725; B5 1.75,4.725; B6 0.75,4.725; B7 -0.75,4.725; B8 -1.75,4.725 | drill 0.65 pad 1.05: SH1 -4.32,0; SH2 4.32,0; SH3 -4.32,4.15; SH4 4.32,4.15 | hole 0.7: -2.89,3.65; 2.89,3.65
NORDIC_NRF_2_RESC0402_L = smd 0.5 x 0.6: 1 -0.5,0; 2 0.5,0
ESP32_C6_LIBRARY_2_IND_4828-WE-TPC_WRE = smd 0.9 x 5.3: 1 -2.286,0; 2 2.286,0
MLP2016SR47MT0S1_INDC2016X100N = smd 1.2 x 2.2: 1 -1.028,0; 2 1.028,0
ESP32_C6_LIBRARY_4_ESP32_C6_LIBRARY_4_ESP32_C6_LIBRARY_4_ESP32_C6_LIBRARY_4_ESP32_WROVER_SPARKFUN-DISCRETESEMI_SOT23-3 = smd 0.8 x 0.9: 1 -0.95,-1; 2 0.95,-1; 3 0,1.1
ESP32_C6_LIBRARY_6_SOT65P210X110-3N = smd 1.05 x 0.5: 1 -1.05,0.65; 2 -1.05,-0.65; 3 1.05,0
ERA-1AEB3401C_0201 = smd 0.35 x 0.25: 1 0,0.275; 2 0,-0.275
ESP32_C6_LIBRARY_7_JUMPER_SJ = smd 1.168 x 1.6: 1 -0.762,0; 2 0.762,0
2025-10-22_07-23-44_LIBRARY_SW_EVP-AKE31A_PAN = smd 0.711 x 1.092: 1 -1.4,-0.972; 2 1.4,-0.972 | drill 0.559 pad 0.914 square: 3 -1.848,0.381; 4 1.848,0.381 | smd 1.397 x 1.092: 5 0,-1.124
HECTOR_WATCH_1_TP20R = smd 2 x 2: TP 0,0
NORDIC_NRF_4_AQFN50P700X700X85_HS-74N = smd 4.85 x 4.85: P$74 0,0 | drill 0.3 pad 0.6: P$75 -1.8,1.8; P$76 -0.6,1.8; P$77 0.6,1.8; P$78 1.8,1.8; P$79 -1.8,0.6; P$80 -0.6,0.6; P$81 0.6,0.6; P$82 1.8,0.6; P$83 -1.8,-0.6; P$84 -0.6,-0.6; P$85 0.6,-0.6; P$86 1.8,-0.6; P$87 -1.8,-1.8; P$88 -0.6,-1.8; P$89 0.6,-1.8; P$90 1.8,-1.8 | smd 0.2 x 0.2: P$A8 -1.25,3.25; P$A10 -0.75,3.25; P$A12 -0.25,3.25; P$A14 0.25,3.25; P$A16 0.75,3.25; P$A18 1.25,3.25; P$A20 1.75,3.25; P$A22 2.25,3.25; P$A23 2.75,3.25; P$AA24 3.25,-2.25; P$AB2 -2.75,-2.5; P$AC5 -2,-2.75; P$AC9 -1,-2.75; P$AC11 -0.5,-2.75; P$AC13 0,-2.75; P$AC15 0.5,-2.75; P$AC17 1,-2.75; P$AC19 1.5,-2.75; P$AC21 2,-2.75; P$AC24 3.25,-2.75; P$AD2 -2.75,-3.25; P$AD4 -2.25,-3.25; P$AD6 -1.75,-3.25; P$AD8 -1.25,-3.25; P$AD10 -0.75,-3.25; P$AD12 -0.25,-3.25; P$AD14 0.25,-3.25; P$AD16 0.75,-3.25; P$AD18 1.25,-3.25; P$AD20 1.75,-3.25; P$AD22 2.25,-3.25; P$AD23 2.75,-3.25; P$B1 -3.25,2.75; P$B3 -2.5,2.75; P$B5 -2,2.75; P$B7 -1.5,2.75; P$B9 -1,2.75; P$B11 -0.5,2.75; P$B13 0,2.75; P$B15 0.5,2.75; P$B17 1,2.75; P$B19 1.5,2.75; P$B24 3.25,2.75; P$C1 -3.25,2.25; P$D2 -2.75,2; P$D23 2.75,2; P$E24 3.25,1.75; P$F2 -2.75,1.5; P$F23 2.75,1.5; P$G1 -3.25,1.25; P$H2 -2.75,1; P$H23 2.75,1; P$J1 -3.25,0.75; P$J24 3.25,0.75; P$K2 -2.75,0.5; P$L1 -3.25,0.25; P$L24 3.25,0.25; P$M2 -2.75,0; P$N1 -3.25,-0.25; P$N24 3.25,-0.25; P$P2 -2.75,-0.5; P$P23 2.75,-0.5; P$R1 -3.25,-0.75; P$R24 3.25,-0.75; P$T2 -2.75,-1; P$T23 2.75,-1; P$U1 -3.25,-1.25; P$U24 3.25,-1.25; P$V23 2.75,-1.5; P$W1 -3.25,-1.75; P$W24 3.25,-1.75; P$Y2 -2.75,-2; P$Y23 2.75,-2
ESP32_C6_LIBRARY_SON50P200X200X80-9N = smd 0.76 x 0.27: 1 -0.985,0.75; 2 -0.985,0.25; 3 -0.985,-0.25; 4 -0.985,-0.75; 5 0.985,-0.75; 6 0.985,-0.25; 7 0.985,0.25; 8 0.985,0.75 | smd 0.9 x 1.3: 9 0,0
NORDIC_NRF_BT-XTAL_2016_N = smd 0.95 x 0.85: 1 -0.725,-0.575; 2 0.725,-0.575; 3 0.725,0.575; 4 -0.725,0.575
NORDIC_NRF_1_XTAL_3215_N = smd 1 x 1.8: 1 -1.25,0; 2 1.25,0

### Placement (x,y rotation side)
ANT1  43.73,24.21 0 top
C1  40.92,17.14 180 top
C1-EP-DR  4.15,2.41 270 top
C2  40.87,20.59 180 top
C2-EP-DR  9.68,6.57 270 top
C3  38.94,16.49 270 top
C4  42.85,16.69 270 top
C5  27.47,24.05 90 top
C6  25.21,17.25 180 top
C7  31.71,13.21 270 top
C8  34.67,14.64 0 top
C9  35.22,17.94 0 top
C10  36.26,24.19 0 top
C11  34.72,20.44 0 top
C12  33.57,22.14 90 top
C13  32.58,22.14 90 top
C14  26.55,20.95 180 top
C15  30.74,24.25 270 top
C16  31.87,24.64 270 top
C17  22.77,21.34 0 top
C18  22.42,19.54 0 top
C19  28.12,9.89 270 top
C20  27.03,15.5 180 top
C21  26.77,12.85 270 top
C22  44.35,16.69 270 top
C23  18.49,22.06 270 top
C24  18.95,21.35 180 top
C25  19.24,19 0 top
C27  8.25,30.56 90 top
C29  33.21,5.31 270 top
C30  15.87,4.06 180 top
C31  21.83,5.26 270 top
C32  18.29,11.66 0 top
C33  19.33,17.95 0 top
C34  18.25,9.26 180 top
C37  17.01,24.36 180 top
C38  20.12,26.91 270 top
C39  19.02,24.55 270 top
C42  27.43,27.16 90 top
C43  27.41,27.9 180 top
D2  9.53,8.05 0 top
D3  24.13,25.25 0 top
D4  9.47,9.15 180 top
D5  9.91,5.75 180 top
EPD_C1  12.23,21.27 180 top
EPD_C2  12.1,22.3 180 top
EPD_C5  11.89,16.99 180 top
EPD_C6  13.65,16.1 180 top
EPD_C7  13.52,14.99 180 top
EPD_C8  13.26,13.96 180 top
EPD_C9  13.32,12.69 180 top
EPD_C10  14.38,11.62 180 top
EPD_C11  12.68,10.77 180 top
EPD_C12  10.83,10.12 180 top
IC1  17.48,26.37 270 top
IC2  18.26,10.44 0 top
IC3  30.68,9.69 90 top
IC9  17.13,19.97 0 top
J1  9.28,17.6 270 top
J2  40.21,12.18 270 top
J4  23.18,33.8 180 top
L1  40.4,16.34 0 top
L2  28.95,22.34 90 top
L3  28.95,24.14 90 top
L5  4.16,7.67 180 top
L7  13.99,18.31 270 top
Q1  24.89,9.88 180 top
Q3  13.49,7.76 90 top
R1_EP_DR  15.99,7.06 270 top
R1_USB  25.25,27.66 270 top
R2  16.71,18.46 180 top
R2_EP_DR  10.57,6.56 90 top
R2_USB  20.83,27.61 270 top
R3  32.39,8.96 270 top
R4  15.75,19.61 90 top
R5  14.51,5.66 180 top
R7  30.47,5.31 180 top
R8  19.73,5.36 180 top
R9  16.89,27.26 0 top
R17  17.35,14.16 270 top
R18  19.81,14.86 270 top
R_PWR_EPD  24.87,11.81 270 top
R_TYPE_SEL  15.93,5.06 180 top
SJ1  17.84,4.27 90 top
SW_DN  34.18,3.1 180 top
SW_ENT  23.18,3.15 180 top
SW_UP  12.18,3.1 180 top
TP_3.3V  21.51,10.17 0 top
TP_3V3  21.06,16.67 0 top
TP_BAT_GND  7.34,32.09 0 top
TP_GND  27.43,7.79 0 top
TP_ON  19.84,8.77 0 top
TP_OP  19.92,11.87 0 top
TP_RESET  38.23,4.54 0 top
TP_SCL  15.98,15.47 0 top
TP_SDA  18.17,15.47 0 top
TP_SWDCLK  40.89,4.49 0 top
TP_SWDIO  43.66,4.54 0 top
TP_SWO  33.57,13.19 0 top
TP_VBAT  10.06,32.19 0 top
TP_VREG  15.92,22.89 0 top
U1  31.31,18.18 0 top
U3  8.74,28.71 270 top
X1  39.02,18.86 90 top
X2  24.3,20.76 270 top

### Tracks (layer width: path | path; a pad name or v marks a point on that pad's centre or on a via)
3V3  (via drill 0.15, 0.3)
  Top 0.15: 39.24,12.8 36.88,12.8
  Top 0.3: C7.1 31.56,13.61 31.56,14.13 | U1.P$AD14 31.56,14.35 | 31.56,14.35 31.56,14.13 | U1.P$Y2 27.81,16.18 | 27.81,16.18 26.78,16.18 26.46,16.5 | 26.46,16.5 C6.1 | U1.P$W1 27.81,16.18 | U1.P$AD23 34.35,14.64 C8.1 34.12,14.64 v33.93,14.45 | U1.P$B1 27.89,20.93 | 27.89,20.93 27.07,20.93 C14.1 | C12.1 33.56,21.87 U1.P$A22 33.53,21.28 33.28,21.03 v33.28,20.96 | IC9.E2 IC9.E3 17.85,18.85 17.93,18.85 | C25.1 17.78,19 17.93,18.85 | C33.1 18.83,18 18.88,18.05 18.48,18.05 17.81,18.72 | 17.81,18.72 17.58,18.5 v17.58,18.2 17.58,18.05 18.96,16.67 19.21,16.67 | 17.81,18.72 17.93,18.85 | TP_3V3.TP 19.21,16.67 | R17.1 19.68,14.16 | 19.68,14.16 20.32,14.16 20.38,14.1 21.08,14.8 | 20.13,15.75 21.08,14.8 | 20.13,15.75 19.21,16.67 | 20.13,15.75 20.13,14.9 R18.1 20.09,14.56 19.68,14.16 | IC2.C2 C34.2 18.16,9.47 v17.53,9.47 | R5.2 15.05,5.93 v15.28,5.7 | v18.68,6.4 19.98,6.4 | R8.2 19.73,6.15 19.98,6.4 | IC3.10 29.37,8.4 29.08,8.4 28.88,8.6 28.88,9.9 29.42,10.44 | 29.42,10.44 IC3.7 | 29.42,10.44 29.26,10.6 28.58,10.6 C19.1 28.01,10.23 27.88,10.23 27.63,10.49 27.48,10.55 | R_PWR_EPD.2 24.33,11.54 | Q1.2 23.94,11 24.41,11.47 24.33,11.54 | 24.33,11.54 23.88,12 23.88,12.1 24.08,12.3 25.53,12.3 | 25.53,12.3 25.88,12.3 25.98,12.2 25.98,11.9 26.18,11.7 27.48,11.7 | 27.48,11.7 30.98,11.7 | 30.98,11.7 31.94,11.7 | 31.94,11.7 35.78,11.7 36.88,12.8 | J2.1 39.24,12.8 | 19.98,6.4 22.83,6.4 | 22.83,6.4 24.48,6.4 | 24.48,6.4 25.68,7.6 25.68,9.5 26.28,10.1 27.03,10.1 27.48,10.55 | 27.48,10.55 27.48,11.7 | R7.2 29.66,6.4 24.48,6.4 | 31.56,14.13 30.93,13.5 30.93,11.75 30.98,11.7 | Q1.2 22.83,9.77 22.83,6.4 | Q1.2 22.53,10.88 | 22.53,10.88 22.22,10.88 TP_3.3V.TP
  Top 0.3: 21.08,14.8 21.48,15.2 v21.48,15.3 | 22.53,10.88 23.08,11.43 v23.08,11.65 | 27.89,20.93 v27.89,21.41 | 31.94,11.7 31.94,10.17 31.75,9.98 31.5,9.98 IC3.3 | 26.46,16.5 25.53,15.57 25.53,12.3 | 31.56,14.35 31.66,14.45 v33.18,14.45
  Bottom 0.3: v15.28,5.7 16.18,6.6 18.48,6.6 v18.68,6.4 | v21.48,15.3 21.48,13.25 22.9,11.83 | 22.9,11.83 v23.08,11.65 | v33.28,20.96 32.83,20.96 31.25,22.55 29.14,22.55 29.09,22.55 | 29.09,22.55 29.04,22.55 v27.89,21.41 | v17.53,9.47 20.54,9.47 22.9,11.83 | 29.09,22.55 29.02,22.68 29.02,29.85 27.82,31.06 18.54,31.06 17.97,30.49 17.97,21.92 19.43,20.45 19.43,20.07 17.59,18.23 v17.58,18.2 | v33.93,14.45 v33.18,14.45
ALERT  (via drill 0.15)
  Top 0.15: v7.78,26.3 7.78,27.51 U3.5 | v34.13,18.6 34.46,18.93 U1.P$J24
  Route2 0.15: v7.78,26.3 7.78,25.75 9.48,24.05 27.33,24.05 28.13,24.85 30.38,24.85 34.53,20.7 34.53,19 v34.13,18.6
D+  (via drill 0.15)
  Top 0.15: D3.4 25.28,24.2 v25.28,23.3 | U1.P$AD6 29.56,14.43 v29.18,14.05
  Bottom 0.15: v29.18,14.05 28.43,13.3 25.88,13.3 25.28,13.9 v25.28,23.3
D-  (via drill 0.15)
  Top 0.15: D3.6 v24.58,27 | U1.P$AD4 29.06,14.68 v28.43,14.05
  Bottom 0.15: v24.58,27 25.28,26.3 25.88,26.3 25.98,26.2 25.98,13.9 26.08,13.8 28.18,13.8 v28.43,14.05
DEC1  (via drill 0.15)
  Top 0.15: U1.P$C1 27.73,20.1 v27.33,20.1 | v27.43,22.7 27.43,23.51 C5.1
  Bottom 0.15: v27.43,22.7 27.43,20.2 v27.33,20.1
DEC3
  Top 0.15: U1.P$D23 34.32,20.44 C11.1
DEC4_6  (via drill 0.15)
  Top 0.15: U1.P$B5 29.31,21.23 29.48,21.4 29.48,22.25 29.53,22.3 29.53,25.12 | 29.53,25.12 29.53,25.22 L3.2 | C15.1 30.73,25.3 | C16.1 31.87,25.44 31.88,25.45 | 29.53,25.12 29.71,25.3 30.73,25.3 | 30.73,25.3 30.88,25.45 31.88,25.45 | 31.88,25.45 34,25.45 35.61,23.84 | v35.23,22.45 35.61,22.82 35.61,23.84 | U1.P$E24 35.85,19.93 v35.98,19.8 | 35.61,23.84 35.66,23.84 C10.1
  Bottom 0.15: v35.98,19.8 35.98,21.7 v35.23,22.45
DN  (via drill 0.15)
  Top 0.15: J4.A7 22.93,27.95 v22.88,27.9 | J4.B7 23.93,28.15 24.38,27.7 D3.1 22.28,26.8 v21.68,26.8
  Bottom 0.15: v21.68,26.8 22.78,27.9 v22.88,27.9
DP
  Top 0.15: J4.B6 22.43,28.45 21.98,28 21.98,27.9 | 21.98,27.9 20.93,26.85 20.78,26.85 20.78,26 22.48,24.3 D3.3 | J4.A6 23.43,28.15 23.68,27.9 23.68,27.7 23.18,27.2 22.48,27.2 21.98,27.7 21.98,27.9
EPD_3V1
  Top 0.15: C2-EP-DR.1 8.76,7.07 D2.1 7.72,8.11 D4.2
EPD_3V3  (via drill 0.15)
  Top 0.3: 11.3,16.27 11.23,16.35 J1.15 | 11.3,16.27 11.43,16.15 | C1-EP-DR.1 4.15,3.77 v4.38,4 3.08,4 1.87,5.2 L5.2 | Q1.3 24.81,8.7 v23.58,8.7 | J1.16 11.13,15.85 11.43,16.15 | 11.43,16.15 11.63,16.15 12.08,16.15 v12.18,16.25 | EPD_C5.2 11.64,16.6 11.3,16.27
  Bottom 0.3: v4.38,4 5.98,4 6.48,3.5 7.38,3.5 8.08,4.2 13.28,4.2 13.98,4.9 13.98,7.2 15.28,8.5 15.73,8.5 | 15.73,8.5 23.38,8.5 v23.58,8.7 | v12.18,16.25 12.18,14.3 12.78,13.7 12.78,11.45 15.73,8.5
EPD_BUSY  (via drill 0.15)
  Top 0.15: v31.08,14.4 31.06,14.42 U1.P$AD12 | J1.9 10.23,19.35 v10.03,19.55
  Route2 0.15: v10.03,19.55 23.13,19.55 28.13,14.55 29.58,14.55 30.03,14.1 30.03,13.6 30.28,13.35 30.33,13.35 31.08,14.1 v31.08,14.4
EPD_CS  (via drill 0.15)
  Top 0.127: U1.P$K2 28.58,18.74 v28.58,18.8
  Top 0.15: J1.12 10.76,17.8 v9.48,17.8
  Route2 0.15: v9.48,17.8 8.33,18.95 8.33,19.55 10.53,21.75 24.93,21.75 26.83,19.85 26.83,19.75 27.01,19.57 27.61,19.57 27.78,19.75 28.08,19.75 28.48,19.35 28.48,18.9 v28.58,18.8
EPD_DC  (via drill 0.15)
  Top 0.15: v30.48,14.75 30.48,14.85 U1.P$AD10 | J1.11 10.03,18.35 v9.93,18.45
  Route2 0.15: v30.48,14.75 30.38,14.85 29.23,14.85 28.83,15.25 28.83,15.9 28.53,16.2 26.98,16.2 23.18,20 23.18,20.25 23.73,20.8 23.53,21 10.48,21 8.73,19.25 8.73,19 9.28,18.45 v9.93,18.45
EPD_RST  (via drill 0.15)
  Top 0.15: v30.73,15.45 30.75,15.43 U1.P$AC11 | J1.10 9.58,18.85 v9.43,19
  Route2 0.15: v30.73,15.45 30.98,15.2 30.98,14.95 31.03,14.9 31.38,14.9 31.63,14.65 31.63,14.15 30.38,12.9 27.43,12.9 21.33,19 v9.43,19
GDR  (via drill 0.15, 0.3)
  Top 0.127: v8.64,15.25 8.64,20.96 10.48,22.8 10.8,22.8 J1.2
  Top 0.15: R2_EP_DR.2 11.44,6.56 v11.58,6.7 Q3.1
  Bottom 0.127: v8.64,15.25 8.64,9.66 11.56,6.74 v11.58,6.7
GND  (via drill 0.15, 0.3)
  Top 0.15: 15.9,26.17 IC1.D2 | IC9.C1 IC9.B1
  Top 0.3: 13.48,21.12 12.88,21.12 EPD_C1.1 | C23.1 19.05,22.06 | 19.05,22.06 19.92,22.06 20.28,21.7 | 20.28,21.7 19.93,21.35 C24.1 | 20.28,21.7 20.88,21.7 21.02,21.66 21.59,21.09 21.63,21 21.63,20.65 | IC9.C1 IC9.C2 IC9.C3 | IC9.C1 16.51,19.97 15.78,20.7 15.69,20.77 15.24,20.77 15.05,20.96 13.59,20.96 13.48,21 | IC3.9 IC3.8 30.04,9.91 v30.48,9.91 | SW_DN.1 35.58,4.9 35.17,5.31 | 35.17,5.31 C29.1 33.59,5.41 v33.59,5.85 | 35.17,5.31 35.53,5.67 35.53,5.9 35.63,5.98 37.15,5.98 40.13,8.96 40.13,9.66 39.69,10.1 39.69,10.49 J2.5 39.63,10.61 39.63,11.82 J2.3 | SW_ENT.1 24.58,5.05 23.83,5.8 | 23.83,5.8 22.65,5.8 C31.1 | 23.83,5.8 24.78,5.8 24.89,5.72 29.53,5.72 v29.59,5.66 | C16.2 31.87,23.79 31.54,23.46 | 31.54,23.46 30.88,22.8 | X1.4 38.2,18.13 v37.43,18.9 | C1.1 41.18,18.29 41.38,18.5 41.38,19.3 | 41.38,19.3 41.38,20 | 41.38,20 41.38,20.33 C2.1 | v40.48,18.85 40.93,19.3 41.38,19.3 | X1.2 39.8,19.78 41.17,19.78 41.38,20 | C3.2 38.89,16.28 38.35,16.28 38.03,16.6 37.68,16.6 37.43,16.35 37.08,16.35 v36.83,16.6 36.77,16.64 35.5,17.92 C9.2 | EPD_C12.1 14.5,10.12 14.88,10.5 | 14.88,10.5 14.88,11.2 | 14.88,11.2 EPD_C10.1 14.88,12.3 | 14.88,12.3 14.88,12.65 | EPD_C11.1 14.45,10.77 14.88,11.2 | EPD_C9.1 14.21,12.3 14.88,12.3 | 14.33,13.8 14.33,14.68 EPD_C7.1 13.85,15.29 13.85,15.76 EPD_C6.1 | 14.33,13.8 14.33,13.05 14.73,12.65 14.88,12.65 | EPD_C8.1 13.93,13.8 14.33,13.8 | EPD_C5.1 12.15,17.91 v12.58,18.35 12.45,18.42 12.45,19.76 12.34,19.86 | v15.03,13.4 14.88,13.25 14.88,12.65 | J1.8 12.33,19.85 12.34,19.86 | 13,21.9 EPD_C2.1 12.58,22.45 12.58,22.49 10.99,24.07 10.23,24.07 | 12.34,19.86 13.48,21 | 13.48,21 13.48,21.12
  Top 0.3: 13.48,21.12 13.48,21.27 12.93,21.82 13,21.9 | C18.1 22.17,19.61 21.63,20.15 21.63,20.65 | 21.68,20.7 22.32,21.34 C17.1 22.61,21.56 22.61,22.23 23.82,23.44 | 21.63,20.65 21.68,20.7 | 21.68,20.7 22.58,20.7 22.61,20.84 25.96,20.84 C14.2 | C15.2 30.88,23.61 30.88,22.8 | 30.88,22.8 30.23,22.15 v30.23,22.1 | v29.83,20.95 U1.P$B7 29.78,20.84 29.53,20.58 29.53,20.01 U1.P$75 29.66,20.01 30.67,20.01 U1.P$74 | SW_UP.1 13.87,3.78 C30.1 16,3.75 16.32,4.07 | U1.P$F23 v34.04,19.7 v34.03,19.7 33.91,19.76 33.72,19.95 33.15,19.95 U1.P$78 33.15,19.82 33.15,18.87 U1.P$82 33.15,18.74 33.15,17.72 U1.P$86 33.15,17.53 33.15,16.52 U1.P$90 33.09,16.39 32.01,16.39 U1.P$89 31.88,16.39 30.86,16.39 U1.P$88 30.67,16.39 29.66,16.39 U1.P$87 29.53,16.39 29.53,17.53 U1.P$74 | C25.2 20.28,19 20.88,18.4 20.43,17.95 C33.2 19.82,17.85 v19.82,17.22 | 29.08,27.65 28.83,27.9 C43.1 27.8,28.41 27.12,29.09 26.99,29.09 | 29.08,27.65 28.59,27.16 C42.2 27.75,27.06 27.5,26.8 27.5,24.58 C5.2 27.37,24.52 25.72,22.87 25.09,22.87 24.58,23.38 23.94,23.38 23.82,23.44 | v31.69,12.45 31.69,12.9 C7.2 | 32.23,8.36 31.05,7.18 29.28,7.18 29.13,7.15 28.49,7.79 TP_GND.TP 28.13,7.88 28.13,9.6 C19.2 | 32.23,8.36 32.64,8.77 32.64,8.9 R3.1 | v32.2,8.39 32.23,8.36 | R2_USB.2 20.51,27.57 20.39,27.44 20.39,26.93 C38.1 20.32,26.8 20.32,25.28 19.05,24.01 C39.2 19.05,23.88 19.05,22.06 | 23.82,23.44 23.82,24.71 23.31,25.22 22.93,25.22 D3.2 | J4.A12_B1 19.94,29.09 19.37,29.09 18.86,29.6 J4.SH4 18.86,29.79 J4.SH2 | v25.53,27.12 25.53,27.63 R1_USB.1 | 26.99,29.09 26.42,29.09 J4.A1_B12 | 26.99,29.09 27.5,29.6 J4.SH3 27.5,29.79 J4.SH1
  Top 0.3: U1.P$74 29.53,17.6 U1.P$83 29.53,17.72 29.53,18.74 U1.P$79 | U1.P$84 30.67,17.6 30.67,17.79 U1.P$74 | U1.P$80 30.74,18.74 30.74,18.11 U1.P$74 | U1.P$85 31.88,17.6 31.37,18.11 U1.P$74 | U1.P$81 31.88,18.74 31.37,18.23 U1.P$74 | U1.P$74 30.74,20.01 U1.P$76 30.86,20.01 31.88,20.01 U1.P$77 | 31.54,23.46 32.52,22.49 C13.2 32.64,22.42 33.53,22.42 C12.2 33.72,22.36 33.85,22.36 34.23,21.98 35.37,21.98 36.52,23.12 C10.2 36.45,24.33 36.45,24.52 33.34,27.63 29.21,27.63 29.08,27.65 | 43.44,16.45 42.87,16.45 C4.2 | 43.44,16.45 44.33,16.45 C22.2 | v43.44,16.58 43.44,16.45 | v35.31,13.91 35.31,13.98 34.95,14.33 C8.2 | J1.17 10.8,15.31 10.35,15.31 8.19,13.15 8.19,11.12 J1.MP2 8.32,11.06 10.61,8.77 | 10.61,8.77 10.93,9.09 11.18,9.09 D4.1 11.37,9.15 11.94,9.15 13.15,7.95 14.23,7.95 15.85,9.56 | 10.61,8.77 10.35,8.52 10.35,6.61 R2_EP_DR.1 10.35,6.42 10.35,5.66 6.61,1.91 4.19,1.91 C1-EP-DR.2 | U3.6 8.51,27.76 8.51,28.46 8.7,28.65 U3.9 | U3.1 9.46,29.66 9.46,29.22 8.96,28.71 8.89,28.71 U3.9 | U3.9 8.58,28.71 8,29.28 8,29.54 U3.4 8,29.73 8,30.55 C27.1 7.94,30.68 7.94,31.38 7.37,31.95 TP_BAT_GND.TP 7.37,32.14 8.7,33.47 10.61,33.47 16.11,27.97 | 16.11,27.97 16.51,27.57 16.83,27.57 R9.1 | 16.73,20.02 16.72,20.01 IC9.C1 | 13,21.9 15.31,24.2 16.2,24.2 16.26,24.14 16.96,24.14 C37.1 | 10.23,24.07 8.19,24.07 J1.MP1 | 16.32,4.07 16.32,4.58 16.13,4.77 15.94,4.77 R_TYPE_SEL.1 | 16.32,4.07 16.45,4.01 17.34,4.01 17.78,3.56 SJ1.1 17.97,3.56 18.16,3.56 18.93,4.33 18.93,5.72 18.74,5.91 18.54,5.91 18.23,6.23 18.23,8.96 | 26.1,12.96 26.1,14.68 26.48,15.06 26.48,15.44 C20.2 | 26.1,12.96 26.74,12.33 C21.2
  Top 0.3: v19.24,10.49 18.8,10.49 IC2.B3 | 18.23,8.96 16.45,8.96 15.85,9.56 | 15.85,9.56 14.99,10.42 14.88,10.5 | 18.23,8.96 C34.1 | v18.29,12.45 18.29,11.95 C32.1 | v21.15,12.83 24.7,16.39 24.7,17.22 C6.2 | v26.04,12.83 26.1,12.96 | 10.23,24.07 10.23,27.88 9.27,28.84 U3.9 | v35.43,20.4 35.02,20.4 C11.2 | 15.9,26.17 15.88,26.15 15.21,26.82 15.21,27.07 16.11,27.97 | IC2.B1 17.44,10.44 v17.28,10.6
  Route2 0.3: v35.31,13.91 35.31,14.49 36.77,15.95 36.77,16.58 v36.83,16.6
  Bottom 0.3: v36.83,16.6 36.83,17.6 36.53,17.9 36.53,18.55 | 36.53,18.55 35.83,19.25 34.28,19.25 34.03,19.5 v34.03,19.7 34.28,19.95 35.13,19.95 35.28,19.8 35.43,19.95 v35.43,20.4 | v12.58,18.35 12.58,17.5 12.73,17.35 12.73,15.7 v15.03,13.4 15.18,13.34 15.94,13.34 17.31,11.98 | v29.83,20.95 29.83,21.7 v30.23,22.1 | v31.69,12.45 31.69,11.12 v30.48,9.91 30.67,9.91 v32.2,8.39 32.2,8.26 31.69,7.76 | 31.69,7.76 v29.59,5.66 | 31.69,7.76 v33.59,5.85 33.72,5.79 37.72,5.79 38.04,5.47 39.25,5.47 44.33,10.55 44.33,16.58 v43.44,16.58 42.74,16.58 40.58,18.74 v40.48,18.85 40.43,18.9 v37.43,18.9 37.34,18.8 36.83,18.8 36.64,18.61 36.53,18.55 | 25.53,27.63 v25.53,27.12 | 25.53,27.63 27.5,29.6 J4.SH3 | 21.09,28.33 19.82,29.6 18.86,29.6 J4.SH4 | 21.09,28.33 24.77,28.33 25.4,27.69 25.53,27.63 | v19.24,10.49 18.8,10.49 17.56,11.72 | 17.31,11.98 17.56,11.72 | 17.56,11.72 v18.29,12.45 18.42,12.52 18.74,12.83 19.82,12.83 | 19.82,12.83 v21.15,12.83 | 19.82,12.83 19.82,15.76 | 19.82,15.76 v19.82,17.22 19.88,17.34 21.02,18.49 21.02,28.2 21.09,28.33 | v26.04,12.83 24.58,12.83 21.66,15.76 19.82,15.76 | v17.28,10.6 17.28,11.95 17.31,11.98
  pour Top: -4.22,36.75 49.73,36.75 54.63,31.85 50.43,27.65 50.43,-0.9 47.93,-3.4 -3.97,-3.4 -3.97,36.5
  pour Route63: -4.12,37.3 48.13,37.3 50.63,34.8 50.63,-0.9 47.88,-3.65 -3.62,-3.65 -4.77,-2.5
  pour Bottom: -3.72,37.45 -3.32,37.05 49.28,37.05 49.28,-3.3 48.28,-4.3 -2.67,-4.3 -4.02,-2.95
GND1
  Top 0.15: R_TYPE_SEL.2 15.93,5.74 16.18,5.99 | 16.18,5.99 16.53,6.34 17.34,6.34 17.84,5.84 SJ1.2 | R1_EP_DR.1 16.18,6.97 16.18,5.99
GND2
  Top 0.15: R1_USB.2 24.43,28.2 J4.A5
HAPTIC_EN
  Top 0.15: IC2.A1 17.76,12.58 18.28,13.1 20.78,13.1 24.08,16.4 24.08,17.8 24.28,18 26.18,18 26.28,17.9 26.28,17.3 26.98,16.6 27.73,16.6 U1.P$U1
IMU_INT1  (via drill 0.3)
  Top 0.127: v23.05,16.39 23.05,17.85 24.01,18.8 27.27,18.8 27.63,18.45 27.63,18.36 28.01,17.98 U1.P$N1 | v30.29,10.99 30.55,10.99 30.93,10.61 30.93,10.49 IC3.5
  Route2 0.127: v23.05,16.39 23.05,12.39 24.51,10.93 24.51,9.85 24.89,9.47 28.77,9.47 v30.29,10.99
LX1  (via drill 0.15)
  Top 0.15: IC9.B2 IC9.B3 18.11,20.37 18.28,20.2 18.88,20.2 v18.98,20.3 | v14.88,20.5 14.88,20.23 L7.1
  Bottom 0.15: v18.98,20.3 15.08,20.3 v14.88,20.5
LX2
  Top 0.15: IC9.D2 IC9.D3 20.68,19.57 21.25,19 21.38,19 22.3,18.08 22.3,15.42 20.58,13.7 15.58,13.7 14.73,14.55 14.73,17.28 L7.2
MOSI  (via drill 0.15)
  Top 0.15: J1.14 9.78,16.85 v9.58,16.65 | U1.P$B13 v31.33,20.95
  Route2 0.15: v9.58,16.65 9.53,16.65 7.58,18.6 7.58,19.95 10.43,22.8 26.78,22.8 28.08,24.1 28.08,24.2 30.38,24.2 31.83,22.75 31.83,21.45 v31.33,20.95
N$1
  Top 0.15: IC1.D1 R9.2
N$2
  Top 0.15: IC9.D1 16.69,19.61 R4.2
N$3
  Top 0.15: R2.2 16.71,19.15 IC9.E1
N$4
  Top 0.15: U1.P$N24 C9.1
N$5
  Top 0.15: U1.P$H23 34.13,19.25 34.73,19.25 35.61,18.37 36.56,18.37 37.88,17.05 39.03,17.05 39.28,16.8 | L1.1 39.48,16.75 39.33,16.75 39.28,16.8 | C3.1 39.23,16.74 39.28,16.8
N$6  (via drill 0.15)
  other vias: 24.18,26
N$9
  Top 0.15: IC3.1 31.48,8.96 R3.2
N$10
  Top 0.15: U1.P$B3 28.81,21.7 L2.1
N$11
  Top 0.15: L2.2 L3.1
N$12
  Top 0.15: U1.P$B24 35.51,20.93 36.78,19.66 36.78,18.6 38.03,17.35 39.23,17.35 | 39.23,17.35 39.6,17.71 X1.1 | C1.2 39.44,17.14 39.23,17.35
N$13
  Top 0.15: U1.P$A18 32.56,21.86 C13.1
N$16
  Top 0.15: U1.P$A23 36,21.43 37.71,19.72 | 37.71,19.72 37.85,19.58 X1.3 | C2.2 38.19,20.59 37.71,20.11 37.71,19.72
N$17  (via drill 0.15)
  Top 0.127: 7.55,6.37 7.56,6.42 7.56,6.55 6.48,7.63 L5.1
  Top 0.15: D5.2 7.08,5.75 | C2-EP-DR.2 9.38,6.37 7.55,6.37 7.08,5.9 7.08,5.75 | 7.08,5.75 7.08,5.35 v7.08,4.3 | Q3.3 v14.38,8.8
  Bottom 0.15: v7.08,4.3 7.58,4.8 13.08,4.8 13.48,5.2 13.48,7.9 v14.38,8.8
N$18
  Top 0.15: J1.4 11.15,21.85 EPD_C2.2
N$19
  Top 0.15: EPD_C1.2 10.89,21.27 J1.5
N$21
  Top 0.15: J1.18 11.9,14.85 EPD_C6.2
N$22
  Top 0.15: J1.19 10.86,14.4 11.98,14.4 12.57,14.99 EPD_C7.2
N$23
  Top 0.15: J4.B5 21.43,27.93 R2_USB.1
N$24
  Top 0.15: EPD_C8.2 10.92,13.96 J1.20
N$26
  Top 0.15: J1.22 11.14,12.85 12.37,11.62 EPD_C10.2
N$28
  Top 0.15: J1.24 10.81,10.59 EPD_C12.2
OUT+
  Top 0.15: TP_OP.TP 19.69,11.87 IC2.A3
OUT-
  Top 0.15: TP_ON.TP 18.76,9.85 IC2.C3
P0.0/XL1
  Top 0.15: U1.P$D2 28.43,20.31 28.43,21.85 28.23,22.05 24.34,22.05 X2.1 23.63,21.34 C17.2
P0.0/XL2
  Top 0.15: C18.2 22.71,19.51 X2.2 27.59,19.51 27.98,19.9 28.08,19.9 28.3,19.68 U1.P$F2
P0.13  (via drill 0.15)
  Top 0.15: SW_UP.2 10.88,4.17 10.88,4.8 11.08,5 14.38,5 v14.68,4.7 | C30.2 15.45,4.33 15.08,4.7 v14.68,4.7 | R5.1 14.51,4.87 v14.68,4.7 | v29.28,12.25 30.06,13.03 U1.P$AD8
  Bottom 0.15: v14.68,4.7 14.68,5.7 16.58,7.6 24.83,7.6 25.33,8.1 25.33,8.3 v29.28,12.25
P0.13/1.5D1
  Top 0.15: IC2.A2 18.26,11.35 C32.2
P0.14  (via drill 0.15)
  Top 0.15: C31.2 20.8,4.5 v20.68,4.5 | SW_ENT.2 21.2,4.12 21.08,4 20.88,4 20.68,4.2 v20.68,4.5 | R8.1 20.32,4.5 v20.68,4.5 | U1.P$AC9 30.05,15.43 v30.03,15.45
  Bottom 0.15: v20.68,4.5 21.98,5.8 29.08,5.8 29.83,6.55 29.83,15.25 v30.03,15.45
P1.01  (via drill 0.15)
  Top 0.15: Q1.1 25.84,10.81 v25.03,10 25.15,10.11 R_PWR_EPD.1 | U1.P$Y23 v34.08,16.16 v34.08,16.15
  Route2 0.15: v25.03,10 28.03,10 33.96,15.92 33.96,16.02 v34.08,16.15
P1.02  (via drill 0.15)
  Top 0.15: R7.1 31.01,4.5 31.63,4.5 | SW_DN.2 32.06,4.07 31.63,4.5 | C29.2 32.44,5.31 | 32.44,5.31 31.63,4.5 | U1.P$W24 34.58,16.45 v35.03,16.45 | 32.44,5.31 33.98,6.85 v33.98,10.05
  Bottom 0.15: v35.03,16.45 34.68,16.1 34.68,10.75 v33.98,10.05
PMIC_INT  (via drill 0.15, 0.3)
  Top 0.127: v18.54,26.68 18.48,26.61 18.1,26.61 IC1.A1
  Top 0.15: U1.P$T2 28.56,16.73 v28.53,16.7
  Route2 0.127: v18.04,16.84 18.67,16.84 v22.29,13.22
  Bottom 0.127: v18.54,26.68 18.54,21.85 19.82,20.58 19.82,18.61 v18.04,16.84 | v22.29,13.22 23.69,13.22 24.51,12.39 28.07,12.39 29.53,13.85 29.53,14.23 28.77,14.99 28.07,14.99 27.88,15.18 27.88,16.01 28.51,16.64 v28.53,16.7
PREVGH  (via drill 0.15)
  Top 0.127: 11.88,13.3 11.94,13.28 v11.98,13.3
  Top 0.15: J1.21 11.11,13.35 11.47,12.99 | EPD_C9.2 11.77,12.69 11.47,12.99 | 11.47,12.99 11.57,12.99 11.88,13.3 | v12.88,5.6 12.73,5.75 D5.1
  Bottom 0.15: v11.98,13.3 11.98,11.4 12.78,10.6 12.78,8.7 12.98,8.5 12.98,6 12.88,5.9 v12.88,5.6
PREVGL  (via drill 0.15)
  Top 0.127: 11.76,11.7 11.75,11.69 11.68,11.7
  Top 0.15: J1.23 11.11,12.35 11.76,11.7 12.18,11.27 EPD_C11.2 | 11.68,11.7 11.48,11.5 v11.48,11.1 | D2.2 12.33,8.05 v12.38,8.1
  Bottom 0.15: v11.48,11.1 11.48,10.55 12.48,9.55 12.48,8.2 v12.38,8.1
RESE  (via drill 0.15, 0.3)
  Top 0.127: v9.08,16.01 9.08,20.9 10.48,22.3 10.8,22.3 J1.3 | v12.19,7.31 12.39,7.31 12.51,7.44 13.4,7.44 14.1,6.74 Q3.2
  Top 0.15: Q3.2 14.87,6.71 v14.97,6.61 | v14.97,6.61 v14.98,6.6 | R1_EP_DR.2 15.27,6.61 v14.97,6.61
  Bottom 0.127: v9.08,16.01 9.08,10.42 v12.19,7.31
RESET  (via drill 0.15)
  Top 0.15: TP_RESET.TP 38.23,5.9 v38.18,5.95
  Top 0.3: v31.43,15.4 31.4,15.43 U1.P$AC13 | J2.6 v40.84,10.59 v40.83,10.6
  Bottom 0.15: 38.48,8.25 38.68,8.05 39.23,8.05 40.33,9.15 40.33,10.1 v40.83,10.6 | v38.18,5.95 38.18,7.95 38.48,8.25 | v31.43,15.4 32.23,14.6 32.23,10.95 34.93,8.25 38.48,8.25
RF
  Top 0.15: L1.2 41.77,16.34 42.23,16.8 42.23,17.25 42.43,17.45 42.93,17.45 | 42.93,17.45 44.49,17.45 | 44.49,17.45 44.63,17.45 44.35,17.17 C22.1 | C4.1 42.85,17.37 42.93,17.45 | 44.49,17.45 42.23,19.71 ANT1.1
SCK  (via drill 0.15)
  Top 0.15: J1.13 10.71,17.25 v9.93,17.25 | U1.P$A12 31.06,21.88 v31.18,22
  Route2 0.15: v9.93,17.25 9.33,17.25 7.93,18.65 7.93,19.85 10.13,22.05 29.23,22.05 29.98,22.8 30.38,22.8 v31.18,22
SCL  (via drill 0.15, 0.3)
  Top 0.127: v15.81,18.42 15.98,18.42 | v31.25,8.39 30.99,8.64 30.99,8.9 IC3.12 | 17.89,13.11 v17.78,13.22
  Top 0.15: U3.7 8.99,26.51 v8.78,26.3 8.78,25.95 8.08,25.25 6.18,25.25 5.93,25.5 5.93,33.5 6.28,33.85 12.23,33.85 18.13,27.95 18.13,27.45 17.68,27 IC1.B1 | R4.1 15.48,19.31 15.98,18.8 15.98,18.42 TP_SCL.TP 15.98,15.25 R17.2 | IC2.C1 17.31,9.94 16.68,10.57 16.68,11.9 17.89,13.11 18.18,13.4 20.68,13.4 23.78,16.5 23.78,18.2 23.98,18.4 v27.18,18.4 | U1.P$M2 28.56,18.13 v28.53,18.1
  Route2 0.127: v31.25,8.39 31.25,9.66 v32.71,11.12
  Bottom 0.127: v8.78,26.3 8.83,26.3 8.83,25.66 15.81,18.68 v15.81,18.42 15.81,15.18 v17.78,13.22 | v32.71,11.12 32.71,14.74 31.31,16.14 31.31,19.06 30.99,19.38 28.64,19.38 28.2,18.93 28.2,18.1 28.2,17.85
  Bottom 0.15: v28.53,18.1 28.2,18.1 | 28.2,17.85 27.73,17.85 v27.18,18.4
SDA  (via drill 0.15, 0.3)
  Top 0.127: v16.64,17.66 16.71,17.66 | 32.83,9.41 31.5,9.41 IC3.2 | 32.83,9.41 33.09,9.15 33.09,8.64 31.18,6.74 28.7,6.74 v28.51,6.93 | v34.1,10.93 34.1,10.68 32.83,9.41
  Top 0.15: U3.8 9.49,26.59 v9.78,26.3 | R2.1 16.71,17.66 16.71,16.93 TP_SDA.TP 18.78,14.86 R18.2 | IC2.B2 18.28,10.42 v18.28,10.4 | IC1.C1 17.28,27.35 17.53,27.6 v17.53,27.85 | U1.P$L1 27.63,18.86 v27.63,19.05
  Route2 0.127: v28.51,6.93 26.55,6.93 23.56,9.91 18.74,9.91 18.29,10.36 v18.28,10.4 18.23,10.42 16.39,12.26 16.39,16.77 16.64,17.03 v16.64,17.66
  Bottom 0.127: v16.64,17.66 16.64,18.23 14.48,20.39 14.48,27.85 | v34.1,10.93 34.29,11.12 34.29,14.61 34.1,14.8 33.78,14.8 32.52,16.07 32.52,19.06 32.2,19.38 31.63,19.38 31.31,19.69 31.31,20.26 30.99,20.58 29.21,20.58 27.69,19.06 v27.63,19.05
  Bottom 0.15: v17.53,27.85 14.48,27.85 11.33,27.85 v9.78,26.3
SWDCLK  (via drill 0.15)
  Top 0.15: J2.4 v41.78,12.8 | v41.78,12.8 | v36.23,13.25 35.78,13.7 35.78,15.35 35.2,15.93 U1.P$AA24 | TP_SWDCLK.TP 40.89,7.71 42.73,9.55 43.68,9.55 44.38,10.25 44.38,12.15 43.73,12.8 v41.78,12.8
  Bottom 0.15: v41.78,12.8 41.68,12.9 36.58,12.9 v36.23,13.25
SWDIO  (via drill 0.15)
  Top 0.15: J2.2 41.08,13.37 v41.08,15.3 41.78,16 43.38,16 44.28,15.1 44.28,13.6 44.93,12.95 44.93,10 43.66,8.73 TP_SWDIO.TP | U1.P$AC24 34.85,15.43 v35.13,15.15
  Bottom 0.15: v41.08,15.3 40.51,15.87 38.01,15.87 37.93,15.95 35.58,15.95 35.13,15.5 v35.13,15.15
SWO
  Top 0.15: TP_SWO.TP U1.P$AD22
VBAT
  Top 0.15: IC1.C2 17.18,26.07 17.18,25.4
  Top 0.3: TP_VBAT.TP 10.06,31.58 9.18,30.7 | 9.18,30.7 8.99,30.51 | 8.99,30.51 8.99,30.56 C27.2 | 8.99,30.19 U3.2 | C37.2 17.01,25.23 | 17.01,25.23 17.18,25.4 | 17.01,25.23 15.15,25.23 10.08,30.3 10.08,30.4 9.78,30.7 9.18,30.7 | U3.3 8.99,30.19 | 8.99,30.19 8.99,30.51
VBUS  (via drill 0.15)
  Top 0.15: IC1.A2 18.26,26.17
  Top 0.3: C21.1 28.15,14.73 | 28.15,14.73 28.2,14.78 28.56,14.78 U1.P$AD2 | C43.2 26.38,27.37 v26.38,27.2 26.41,27.2 26.45,27.16 | D3.5 26.13,25.25 26.68,25.8 26.68,26.93 26.45,27.16 | C42.1 26.45,27.16 | 26.45,27.16 26.45,27.63 26.18,27.9 26.08,27.9 25.78,28.2 25.78,28.87 J4.A4_B9 25.53,29.22 25.53,29.6 25.15,29.98 21.21,29.98 20.83,29.6 20.83,29.22 J4.A9_B4 20.78,28.6 19.33,27.15 19.33,26.39 | 28.15,14.73 26.81,14.73 v26.58,14.5 | 18.26,26.17 19.11,26.17 19.33,26.39 | 19.33,26.39 C38.2
  Bottom 0.3: v26.58,14.5 26.58,27 v26.38,27.2
VBUS/2.6D1  (via drill 0.15)
  Top 0.15: U1.P$AC5 v29.33,15.45
  Top 0.3: C20.1 28.08,15.5 v28.23,15.35
  Bottom 0.3: v29.33,15.45 29.23,15.35 v28.23,15.35
VREG
  Top 0.3: IC1.B2 17.68,25.6 18.23,25.05 | C39.1 18.23,25.05 | IC9.A3 IC9.A2 IC9.A1 17.47,21.51 | 18.23,25.05 17.68,24.5 17.68,23 | 17.68,23 17.68,21.72 | 17.68,21.72 17.47,21.51 | C24.2 17.63,21.35 17.47,21.51 | C23.2 18.02,22.06 17.68,21.72 | 17.68,23 17.57,22.89 TP_VREG.TP
(copper drawn outside any net)
  shapes: Top area x1